# Altium project EPS.PrjPcb (part 3 of 5)

## Sheet EPS_3V3_Buck-Converter.SchDoc: 3V3 / Buck-Converter
size A4; ApprovedBy: (not approved); CheckedBy: (not checked); Author: Piotr Kuligowski; DocumentNumber: PWSat2-xxx-DW-xxx; Revision: 2; Model: EM2
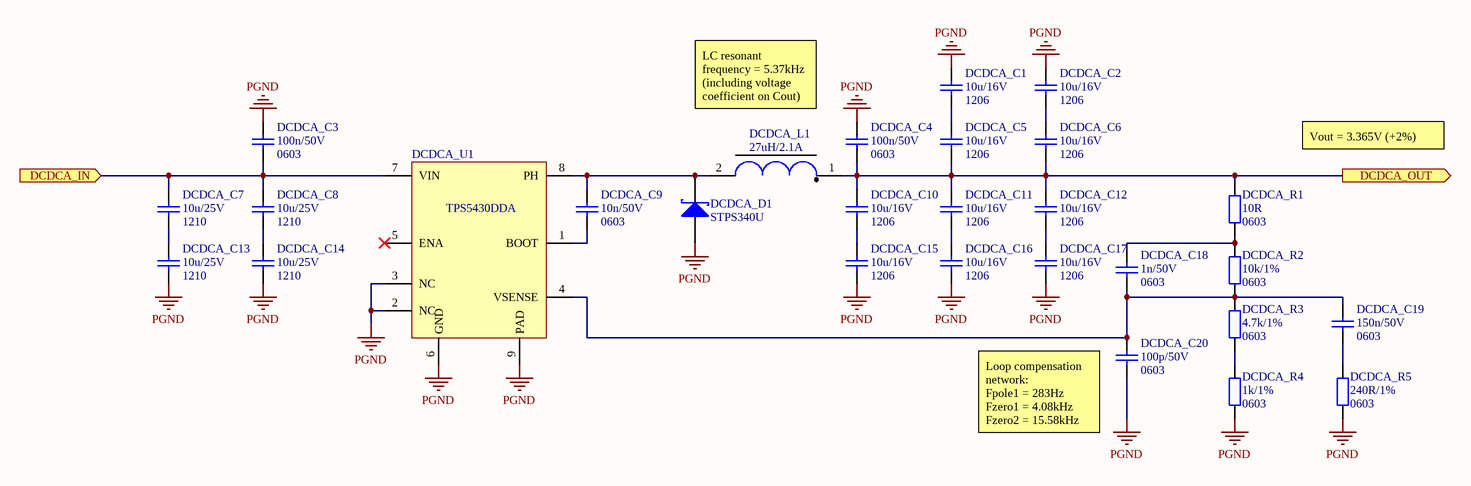
[diagram p23: EPS_3V3_Buck-Converter.SchDoc]

### Parts
DCDCA_C1  Packge: 1206  [SMD_Capacitor_1206]  (hidden comment: 10u/16V)
DCDCA_C2  Packge: 1206  [SMD_Capacitor_1206]  (hidden comment: 10u/16V)
DCDCA_C3  Package: 0603  [SMD_Capacitor_0603]  (hidden comment: 100n/50V)
DCDCA_C4  Package: 0603  [SMD_Capacitor_0603]  (hidden comment: 100n/50V)
DCDCA_C5  Packge: 1206  [SMD_Capacitor_1206]  (hidden comment: 10u/16V)
DCDCA_C6  Packge: 1206  [SMD_Capacitor_1206]  (hidden comment: 10u/16V)
DCDCA_C7  Package: 1210  [SMD_Capacitor_1210]  (hidden comment: 10u/25V)
DCDCA_C8  Package: 1210  [SMD_Capacitor_1210]  (hidden comment: 10u/25V)
DCDCA_C9  value 10n/50V  Package: 0603  [SMD_Capacitor_0603]  (hidden comment: Cap)
DCDCA_C10  Packge: 1206  [SMD_Capacitor_1206]  (hidden comment: 10u/16V)
DCDCA_C11  Packge: 1206  [SMD_Capacitor_1206]  (hidden comment: 10u/16V)
DCDCA_C12  Packge: 1206  [SMD_Capacitor_1206]  (hidden comment: 10u/16V)
DCDCA_C13  Package: 1210  [SMD_Capacitor_1210]  (hidden comment: 10u/25V)
DCDCA_C14  Package: 1210  [SMD_Capacitor_1210]  (hidden comment: 10u/25V)
DCDCA_C15  Packge: 1206  [SMD_Capacitor_1206]  (hidden comment: 10u/16V)
DCDCA_C16  Packge: 1206  [SMD_Capacitor_1206]  (hidden comment: 10u/16V)
DCDCA_C17  Packge: 1206  [SMD_Capacitor_1206]  (hidden comment: 10u/16V)
DCDCA_C18  value 1n/50V  Package: 0603  [SMD_Capacitor_0603]  (hidden comment: Cap)
DCDCA_C19  Package: 0603  [SMD_Capacitor_0603]  (hidden comment: 150n/50V)
DCDCA_C20  value 100p/50V  Package: 0603  [SMD_Capacitor_0603]  (hidden comment: Cap)
DCDCA_D1  STPS340U  [DO-214AA]
DCDCA_L1  27uH/2.1A  [Coilcraft_MSS1260]
DCDCA_R1  Package: 0603  [SMD_Resistor_0603]  (hidden comment: 10R)
DCDCA_R2  Package: 0603  [SMD_Resistor_0603]  (hidden comment: 10k/1%)
DCDCA_R3  Package: 0603  [SMD_Resistor_0603]  (hidden comment: 4.7k/1%)
DCDCA_R4  Package: 0603  [SMD_Resistor_0603]  (hidden comment: 1k/1%)
DCDCA_R5  Package: 0603  [SMD_Resistor_0603]  (hidden comment: 240R/1%)
DCDCA_U1  TPS5430DDA  [DDA-9]

### Ports
DCDCA_IN (in), DCDCA_OUT (out)

### Nets
PGND: DCDCA_C1.1 DCDCA_C2.1 DCDCA_C3.2 DCDCA_C4.2 DCDCA_C13.2 DCDCA_C14.2 DCDCA_C15.2 DCDCA_C16.2 DCDCA_C17.2 DCDCA_C20.2 DCDCA_D1.A DCDCA_R4.1 DCDCA_R5.1 DCDCA_U1.2(NC) DCDCA_U1.3(NC) DCDCA_U1.6(GND) DCDCA_U1.9(PAD)
NetDCDCA_C1_2: DCDCA_C1.2 DCDCA_C5.1
NetDCDCA_C2_2: DCDCA_C2.2 DCDCA_C6.1
NetDCDCA_C3_1: DCDCA_C3.1 DCDCA_C7.1 DCDCA_C8.1 DCDCA_U1.7(VIN) ; port DCDCA_IN
NetDCDCA_C4_1: DCDCA_C4.1 DCDCA_C5.2 DCDCA_C6.2 DCDCA_C10.1 DCDCA_C11.1 DCDCA_C12.1 DCDCA_L1.1 DCDCA_R1.2 ; port DCDCA_OUT
NetDCDCA_C7_2: DCDCA_C7.2 DCDCA_C13.1
NetDCDCA_C8_2: DCDCA_C8.2 DCDCA_C14.1
NetDCDCA_C9_1: DCDCA_C9.1 DCDCA_D1.K DCDCA_L1.2 DCDCA_U1.8(PH)
NetDCDCA_C9_2: DCDCA_C9.2 DCDCA_U1.1(BOOT)
NetDCDCA_C10_2: DCDCA_C10.2 DCDCA_C15.1
NetDCDCA_C11_2: DCDCA_C11.2 DCDCA_C16.1
NetDCDCA_C12_2: DCDCA_C12.2 DCDCA_C17.1
NetDCDCA_C18_1: DCDCA_C18.1 DCDCA_R1.1 DCDCA_R2.2
NetDCDCA_C18_2: DCDCA_C18.2 DCDCA_C19.1 DCDCA_C20.1 DCDCA_R2.1 DCDCA_R3.2 DCDCA_U1.4(VSENSE)
NetDCDCA_C19_2: DCDCA_C19.2 DCDCA_R5.2
NetDCDCA_R3_1: DCDCA_R3.1 DCDCA_R4.2

Not connected (* = marked no-connect by the designer): DCDCA_U1 5(ENA)*

### Notes on the sheet
- LC resonant frequency = 5.37kHz (including voltage coefficient on Cout)
- Vout = 3.365V (+2%)
- (near DCDCA_C20) Loop compensation network:
  Fpole1 = 283Hz
  Fzero1 = 4.08kHz
  Fzero2 = 15.58kHz
- Title:
- Project:
- Author:
- Model:
- Document Number:
- Checked by:
- Rev:
- Date:
- Approved by:
- Sheet:
- of
- File name:

### Library data of the parts
DCDCA_C1 DCDCA_C2 DCDCA_C5 DCDCA_C6 DCDCA_C10-DCDCA_C12 DCDCA_C15-DCDCA_C17 = Cer_C1206T106K4RACTU: Ceramic Cap Kemet COTS 10u/16V X7R 1206; ManufacturerPartNumber: C1206T106K4RACTU; Manufacturer: Kemet; Value: 10u/16V
DCDCA_C3 DCDCA_C4 = Cer_GCJ188R71H104KA12D: as SUMPBX_C2 on sheet EPS_MPPT_X_OR_MPB; Manufacturer: Murata; ManufacturerPartNumber: GCJ188R71H104KA12D; Value: 100n/50V
DCDCA_C7 DCDCA_C8 DCDCA_C13 DCDCA_C14 = Cer_GCJ32ER71E106KA12L: as EMIXI_C1 on sheet EPS_MPPT_X_EMI-Filter_In; Manufacturer: Murata; ManufacturerPartNumber: GCJ32ER71E106KA12L; Value: 10u/25V
DCDCA_C19 = Cer_GCM188R71H154KA64D: Ceramic Cap Murata Automotive 150n/50V X7R 0603; Manufacturer: Murata; ManufacturerPartNumber: GCM188R71H154KA64D; Value: 150n/50V
DCDCA_D1 = STPS340x: 3A/40V Power Schottky Rectifier.; Manufacturer: STMicroelectronics; Value: STPS340U
DCDCA_L1 = MSS1260-273MLx: Coilcraft MSS1260 Inductor, L=27uH, Irise20deg=2.1A, ESR=50mR, SRF=13MHz.; Manufacturer: Coilcraft; ManufacturerPartNumber: MSS1260-273MLx; Value: 27uH/2.1A
DCDCA_R1-DCDCA_R5 = Res
  DCDCA_R1: Value: 10R
  DCDCA_R2: Value: 10k/1%
  DCDCA_R3: Value: 4.7k/1%
  DCDCA_R4: Value: 1k/1%
  DCDCA_R5: Value: 240R/1%
DCDCA_U1 = TPS5430: TPS5430 3-A, Wide Input Range, Step-Down Converter; Manufacturer: Texas Instruments; Value: TPS5430DDA

## Sheet EPS_3V3_EMI-Filter_In.SchDoc: 3V3 / EMI-Filter / In
size A4; ApprovedBy: (not approved); CheckedBy: (not checked); Author: Piotr Kuligowski; DocumentNumber: PWSat2-xxx-DW-xxx; Revision: 2; Model: EM2
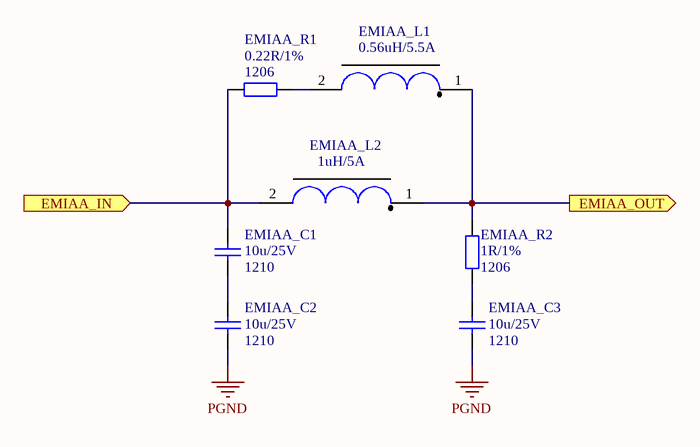
[diagram p24: EPS_3V3_EMI-Filter_In.SchDoc]

### Parts
EMIAA_C1  Package: 1210  [SMD_Capacitor_1210]  (hidden comment: 10u/25V)
EMIAA_C2  Package: 1210  [SMD_Capacitor_1210]  (hidden comment: 10u/25V)
EMIAA_C3  Package: 1210  [SMD_Capacitor_1210]  (hidden comment: 10u/25V)
EMIAA_L1  0.56uH/5.5A  [Vishay_IHLP1212]
EMIAA_L2  1uH/5A  [Vishay_IHLP1212]
EMIAA_R1  Package: 1206  [SMD_Resistor_1206]  (hidden comment: 0.22R/1%)
EMIAA_R2  Package: 1206  [SMD_Resistor_1206]  (hidden comment: 1R/1%)

### Ports
EMIAA_IN (in), EMIAA_OUT (out)

### Nets
PGND: EMIAA_C2.2 EMIAA_C3.2
NetDCDCA_C3_1: EMIAA_L1.1 EMIAA_L2.1 EMIAA_R2.2 ; port EMIAA_OUT
NetEMIAA_C1_1: EMIAA_C1.1 EMIAA_L2.2 EMIAA_R1.1 ; port EMIAA_IN
NetEMIAA_C1_2: EMIAA_C1.2 EMIAA_C2.1
NetEMIAA_C3_1: EMIAA_C3.1 EMIAA_R2.1
NetEMIAA_L1_2: EMIAA_L1.2 EMIAA_R1.2

### Notes on the sheet
- Title:
- Project:
- Author:
- Model:
- Document Number:
- Checked by:
- Rev:
- Date:
- Approved by:
- Sheet:
- of
- File name:

### Library data of the parts
EMIAA_C1-EMIAA_C3 = Cer_GCJ32ER71E106KA12L: as EMIXI_C1 on sheet EPS_MPPT_X_EMI-Filter_In; Manufacturer: Murata; ManufacturerPartNumber: GCJ32ER71E106KA12L; Value: 10u/25V
EMIAA_L1 = IHLP1212BZERR56M11: as EMIXI_L1 on sheet EPS_MPPT_X_EMI-Filter_In; Manufacturer: Vishay; ManufacturerPartNumber: IHLP1212BZERR56M11; Value: 0.56uH/5.5A
EMIAA_L2 = IHLP1212BZER1R0M11: as EMIXI_L2 on sheet EPS_MPPT_X_EMI-Filter_In; Manufacturer: Vishay; ManufacturerPartNumber: IHLP1212BZER1R0M11; Value: 1uH/5A
EMIAA_R1 = ERJ-8BQFR22V: Panasonic Resistor 0.22R 1% 1206 330mW; Manufacturer: Panasonic; ManufacturerPartNumber: ERJ-8BQFR22V; Value: 0.22R/1%
EMIAA_R2 = ERJ-8BQF1R0V: Panasonic Resistor 1R 1% 1206 330mW; ManufacturerPartNumber: ERJ-8BQF1R0V; Manufacturer: Panasonic; Value: 1R/1%

## Sheet EPS_3V3_EMI-Filter_Out.SchDoc: 3V3 / EMI-Filter / Out
size A4; ApprovedBy: (not approved); CheckedBy: (not checked); Author: Piotr Kuligowski; DocumentNumber: PWSat2-xxx-DW-xxx; Revision: 2; Model: EM2
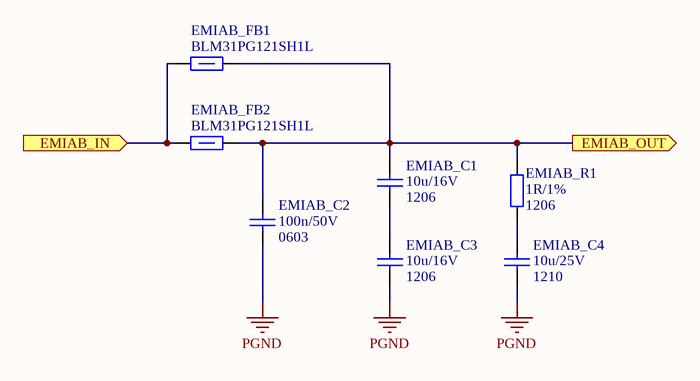
[diagram p25: EPS_3V3_EMI-Filter_Out.SchDoc]

### Parts
EMIAB_C1  Packge: 1206  [SMD_Capacitor_1206]  (hidden comment: 10u/16V)
EMIAB_C2  Package: 0603  [SMD_Capacitor_0603]  (hidden comment: 100n/50V)
EMIAB_C3  Packge: 1206  [SMD_Capacitor_1206]  (hidden comment: 10u/16V)
EMIAB_C4  Package: 1210  [SMD_Capacitor_1210]  (hidden comment: 10u/25V)
EMIAB_FB1  120R/100MHz  [SMD_FerriteBead_1206]  (value not drawn)
EMIAB_FB2  120R/100MHz  [SMD_FerriteBead_1206]  (value not drawn)
EMIAB_R1  Package: 1206  [SMD_Resistor_1206]  (hidden comment: 1R/1%)

### Ports
EMIAB_IN (in), EMIAB_OUT (out)

### Nets
PGND: EMIAB_C2.2 EMIAB_C3.2 EMIAB_C4.2
NetDCDCA_C4_1: EMIAB_FB1.2 EMIAB_FB2.2 ; port EMIAB_IN
NetEMIAB_C1_1: EMIAB_C1.1 EMIAB_C2.1 EMIAB_FB1.1 EMIAB_FB2.1 EMIAB_R1.1 ; port EMIAB_OUT
NetEMIAB_C1_2: EMIAB_C1.2 EMIAB_C3.1
NetEMIAB_C4_1: EMIAB_C4.1 EMIAB_R1.2

### Notes on the sheet
- Title:
- Project:
- Author:
- Model:
- Document Number:
- Checked by:
- Rev:
- Date:
- Approved by:
- Sheet:
- of
- File name:

### Library data of the parts
EMIAB_C1 EMIAB_C3 = Cer_C1206T106K4RACTU: Ceramic Cap Kemet COTS 10u/16V X7R 1206; ManufacturerPartNumber: C1206T106K4RACTU; Manufacturer: Kemet; Value: 10u/16V
EMIAB_C2 = Cer_C0603T104K5RALTU: Ceramic Cap Kemet COTS 100n/50V X7R 0603; Manufacturer: Kemet; ManufacturerPartNumber: C0603T104K5RALTU; Value: 100n/50V
EMIAB_C4 = Cer_GCJ32ER71E106KA12L: as EMIXI_C1 on sheet EPS_MPPT_X_EMI-Filter_In; Manufacturer: Murata; ManufacturerPartNumber: GCJ32ER71E106KA12L; Value: 10u/25V
EMIAB_FB1 EMIAB_FB2 = BLM31PG121SH1L: as EMIXO_FB1 on sheet EPS_MPPT_X_EMI-Filter_Out; Package: 1206; Value: 120R/100MHz; ManufacturerPartNumber: BLM31PG121SH1L
EMIAB_R1 = CRCW12061R00FKxxxx: 1R/1% Vishay CRCW 1206 Resistor. 250mW, 100ppm, 200V.; ManufacturerPartNumber: CRCW12061R00FKxxxx; Manufacturer: Vishay; Value: 1R/1%

## Sheet EPS_5V.SchDoc: 5V
size A4; ApprovedBy: (not approved); CheckedBy: (not checked); Author: Piotr Kuligowski; DocumentNumber: PWSat2-xxx-DW-xxx; Revision: 2; Model: EM2
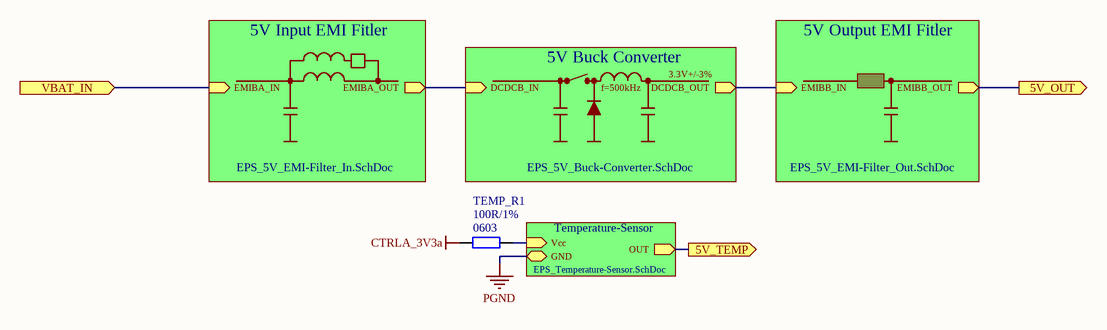
[diagram p26: EPS_5V.SchDoc]

### Parts
TEMP_R1  Package: 0603  [SMD_Resistor_0603]  (hidden comment: 100R/1%)

### Sub-sheets
5V Buck Converter = EPS_5V_Buck-Converter.SchDoc: DCDCB_OUT (out), DCDCB_IN (in)
5V Input EMI Fitler = EPS_5V_EMI-Filter_In.SchDoc: EMIBA_OUT (out), EMIBA_IN (in)
5V Output EMI Fitler = EPS_5V_EMI-Filter_Out.SchDoc: EMIBB_IN (in), EMIBB_OUT (out)
Temperature-Sensor = EPS_Temperature-Sensor.SchDoc: OUT (out), Vcc (in), GND

### Ports
5V_OUT (out), 5V_TEMP (out), VBAT_IN (in)

### Nets
CTRLA_3V3a: TEMP_R1.2
CTRLA_HK_5V_TEMP: port 5V_TEMP, sheet Temperature-Sensor/OUT
NetDCDCB_C3_1: sheet 5V Buck Converter/DCDCB_IN, sheet 5V Input EMI Fitler/EMIBA_OUT
NetDCDCB_C4_1: sheet 5V Buck Converter/DCDCB_OUT, sheet 5V Output EMI Fitler/EMIBB_IN
NetEMIAA_C1_1: port VBAT_IN, sheet 5V Input EMI Fitler/EMIBA_IN
NetEMIBB_C1_1: port 5V_OUT, sheet 5V Output EMI Fitler/EMIBB_OUT
NetTEMP_C1_Top_5V_Temperature-Sensor_1: TEMP_R1.1 ; sheet Temperature-Sensor/Vcc

### Notes on the sheet
- 3.3V+/-3%
- f=500kHz
- Title:
- Project:
- Author:
- Model:
- Document Number:
- Checked by:
- Rev:
- Date:
- Approved by:
- Sheet:
- of
- File name:

### Library data of the parts
TEMP_R1 = CRCW06031K00FKxxxx: 1k/1% Vishay CRCW 0603 Resistor. 100mW, 100ppm, 75V.; Manufacturer: Vishay; ManufacturerPartNumber: CRCW06031K00FKxxxx; Value: 100R/1%

## Sheet EPS_5V_Buck-Converter.SchDoc: 5V / Buck-Converter
size A4; ApprovedBy: (not approved); CheckedBy: (not checked); Author: Piotr Kuligowski; DocumentNumber: PWSat2-xxx-DW-xxx; Revision: 2; Model: EM2
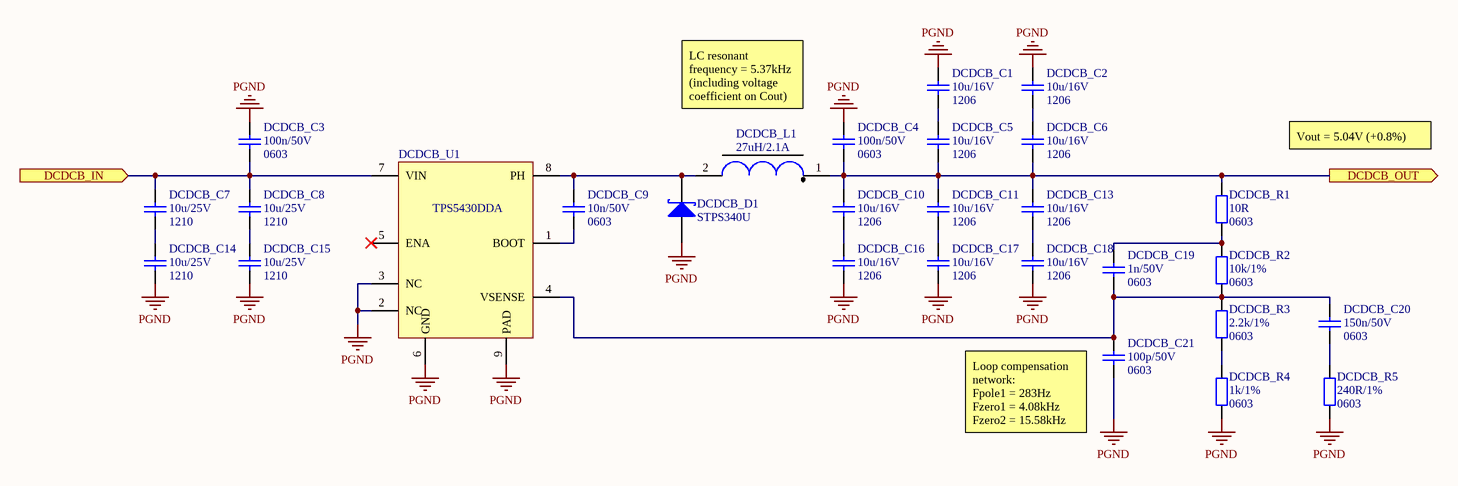
[diagram p27: EPS_5V_Buck-Converter.SchDoc]

### Parts
DCDCB_C1  Packge: 1206  [SMD_Capacitor_1206]  (hidden comment: 10u/16V)
DCDCB_C2  Packge: 1206  [SMD_Capacitor_1206]  (hidden comment: 10u/16V)
DCDCB_C3  Package: 0603  [SMD_Capacitor_0603]  (hidden comment: 100n/50V)
DCDCB_C4  Package: 0603  [SMD_Capacitor_0603]  (hidden comment: 100n/50V)
DCDCB_C5  Packge: 1206  [SMD_Capacitor_1206]  (hidden comment: 10u/16V)
DCDCB_C6  Packge: 1206  [SMD_Capacitor_1206]  (hidden comment: 10u/16V)
DCDCB_C7  Package: 1210  [SMD_Capacitor_1210]  (hidden comment: 10u/25V)
DCDCB_C8  Package: 1210  [SMD_Capacitor_1210]  (hidden comment: 10u/25V)
DCDCB_C9  value 10n/50V  Package: 0603  [SMD_Capacitor_0603]  (hidden comment: Cap)
DCDCB_C10  Packge: 1206  [SMD_Capacitor_1206]  (hidden comment: 10u/16V)
DCDCB_C11  Packge: 1206  [SMD_Capacitor_1206]  (hidden comment: 10u/16V)
DCDCB_C13  Packge: 1206  [SMD_Capacitor_1206]  (hidden comment: 10u/16V)
DCDCB_C14  Package: 1210  [SMD_Capacitor_1210]  (hidden comment: 10u/25V)
DCDCB_C15  Package: 1210  [SMD_Capacitor_1210]  (hidden comment: 10u/25V)
DCDCB_C16  Packge: 1206  [SMD_Capacitor_1206]  (hidden comment: 10u/16V)
DCDCB_C17  Packge: 1206  [SMD_Capacitor_1206]  (hidden comment: 10u/16V)
DCDCB_C18  Packge: 1206  [SMD_Capacitor_1206]  (hidden comment: 10u/16V)
DCDCB_C19  value 1n/50V  Package: 0603  [SMD_Capacitor_0603]  (hidden comment: Cap)
DCDCB_C20  Package: 0603  [SMD_Capacitor_0603]  (hidden comment: 150n/50V)
DCDCB_C21  value 100p/50V  Package: 0603  [SMD_Capacitor_0603]  (hidden comment: Cap)
DCDCB_D1  STPS340U  [DO-214AA]
DCDCB_L1  27uH/2.1A  [Coilcraft_MSS1260]
DCDCB_R1  Package: 0603  [SMD_Resistor_0603]  (hidden comment: 10R)
DCDCB_R2  Package: 0603  [SMD_Resistor_0603]  (hidden comment: 10k/1%)
DCDCB_R3  Package: 0603  [SMD_Resistor_0603]  (hidden comment: 2.2k/1%)
DCDCB_R4  Package: 0603  [SMD_Resistor_0603]  (hidden comment: 1k/1%)
DCDCB_R5  Package: 0603  [SMD_Resistor_0603]  (hidden comment: 240R/1%)
DCDCB_U1  TPS5430DDA  [DDA-9]

### Ports
DCDCB_IN (in), DCDCB_OUT (out)

### Nets
PGND: DCDCB_C1.1 DCDCB_C2.1 DCDCB_C3.2 DCDCB_C4.2 DCDCB_C14.2 DCDCB_C15.2 DCDCB_C16.2 DCDCB_C17.2 DCDCB_C18.2 DCDCB_C21.2 DCDCB_D1.A DCDCB_R4.1 DCDCB_R5.1 DCDCB_U1.2(NC) DCDCB_U1.3(NC) DCDCB_U1.6(GND) DCDCB_U1.9(PAD)
NetDCDCB_C1_2: DCDCB_C1.2 DCDCB_C5.1
NetDCDCB_C2_2: DCDCB_C2.2 DCDCB_C6.1
NetDCDCB_C3_1: DCDCB_C3.1 DCDCB_C7.1 DCDCB_C8.1 DCDCB_U1.7(VIN) ; port DCDCB_IN
NetDCDCB_C4_1: DCDCB_C4.1 DCDCB_C5.2 DCDCB_C6.2 DCDCB_C10.1 DCDCB_C11.1 DCDCB_C13.1 DCDCB_L1.1 DCDCB_R1.2 ; port DCDCB_OUT
NetDCDCB_C7_2: DCDCB_C7.2 DCDCB_C14.1
NetDCDCB_C8_2: DCDCB_C8.2 DCDCB_C15.1
NetDCDCB_C9_1: DCDCB_C9.1 DCDCB_D1.K DCDCB_L1.2 DCDCB_U1.8(PH)
NetDCDCB_C9_2: DCDCB_C9.2 DCDCB_U1.1(BOOT)
NetDCDCB_C10_2: DCDCB_C10.2 DCDCB_C16.1
NetDCDCB_C11_2: DCDCB_C11.2 DCDCB_C17.1
NetDCDCB_C13_2: DCDCB_C13.2 DCDCB_C18.1
NetDCDCB_C19_1: DCDCB_C19.1 DCDCB_R1.1 DCDCB_R2.2
NetDCDCB_C19_2: DCDCB_C19.2 DCDCB_C20.1 DCDCB_C21.1 DCDCB_R2.1 DCDCB_R3.2 DCDCB_U1.4(VSENSE)
NetDCDCB_C20_2: DCDCB_C20.2 DCDCB_R5.2
NetDCDCB_R3_1: DCDCB_R3.1 DCDCB_R4.2

Not connected (* = marked no-connect by the designer): DCDCB_U1 5(ENA)*

### Notes on the sheet
- LC resonant frequency = 5.37kHz (including voltage coefficient on Cout)
- Vout = 5.04V (+0.8%)
- (near DCDCB_C21) Loop compensation network:
  Fpole1 = 283Hz
  Fzero1 = 4.08kHz
  Fzero2 = 15.58kHz
- Title:
- Project:
- Author:
- Model:
- Document Number:
- Checked by:
- Rev:
- Date:
- Approved by:
- Sheet:
- of
- File name:

### Library data of the parts
DCDCB_C1 DCDCB_C2 DCDCB_C5 DCDCB_C6 DCDCB_C10 DCDCB_C11 DCDCB_C13 DCDCB_C16-DCDCB_C18 = Cer_C1206T106K4RACTU: Ceramic Cap Kemet COTS 10u/16V X7R 1206; ManufacturerPartNumber: C1206T106K4RACTU; Manufacturer: Kemet; Value: 10u/16V
DCDCB_C3 DCDCB_C4 = Cer_GCJ188R71H104KA12D: as SUMPBX_C2 on sheet EPS_MPPT_X_OR_MPB; Manufacturer: Murata; ManufacturerPartNumber: GCJ188R71H104KA12D; Value: 100n/50V
DCDCB_C7 DCDCB_C8 DCDCB_C14 DCDCB_C15 = Cer_GCJ32ER71E106KA12L: as EMIXI_C1 on sheet EPS_MPPT_X_EMI-Filter_In; Manufacturer: Murata; ManufacturerPartNumber: GCJ32ER71E106KA12L; Value: 10u/25V
DCDCB_C20 = Cer_GCM188R71H154KA64D: as DCDCA_C19 on sheet EPS_3V3_Buck-Converter; Manufacturer: Murata; ManufacturerPartNumber: GCM188R71H154KA64D; Value: 150n/50V
DCDCB_D1 = STPS340x: as DCDCA_D1 on sheet EPS_3V3_Buck-Converter; Value: STPS340U
DCDCB_L1 = MSS1260-273MLx: as DCDCA_L1 on sheet EPS_3V3_Buck-Converter; Manufacturer: Coilcraft; ManufacturerPartNumber: MSS1260-273MLx; Value: 27uH/2.1A
DCDCB_R1-DCDCB_R5 = Res
  DCDCB_R1: Value: 10R
  DCDCB_R2: Value: 10k/1%
  DCDCB_R3: Value: 2.2k/1%
  DCDCB_R4: Value: 1k/1%
  DCDCB_R5: Value: 240R/1%
DCDCB_U1 = TPS5430: as DCDCA_U1 on sheet EPS_3V3_Buck-Converter; Value: TPS5430DDA

## Sheet EPS_5V_EMI-Filter_In.SchDoc: 5V / EMI-Filter / In
size A4; ApprovedBy: (not approved); CheckedBy: (not checked); Author: Piotr Kuligowski; DocumentNumber: PWSat2-xxx-DW-xxx; Revision: 2; Model: EM2
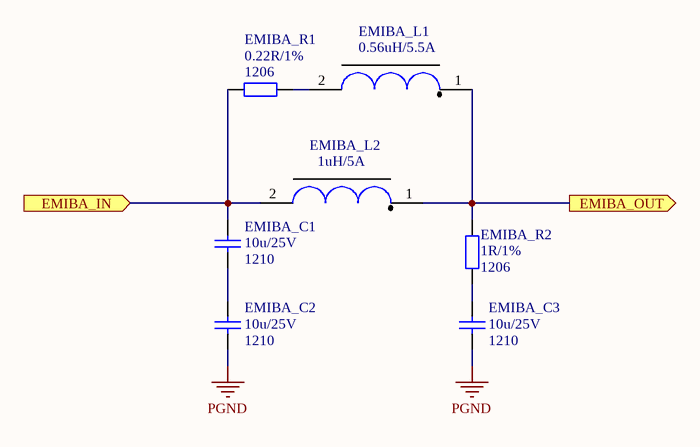
[diagram p28: EPS_5V_EMI-Filter_In.SchDoc]

### Parts
EMIBA_C1  Package: 1210  [SMD_Capacitor_1210]  (hidden comment: 10u/25V)
EMIBA_C2  Package: 1210  [SMD_Capacitor_1210]  (hidden comment: 10u/25V)
EMIBA_C3  Package: 1210  [SMD_Capacitor_1210]  (hidden comment: 10u/25V)
EMIBA_L1  0.56uH/5.5A  [Vishay_IHLP1212]
EMIBA_L2  1uH/5A  [Vishay_IHLP1212]
EMIBA_R1  Package: 1206  [SMD_Resistor_1206]  (hidden comment: 0.22R/1%)
EMIBA_R2  Package: 1206  [SMD_Resistor_1206]  (hidden comment: 1R/1%)

### Ports
EMIBA_IN (in), EMIBA_OUT (out)

### Nets
PGND: EMIBA_C2.2 EMIBA_C3.2
NetDCDCB_C3_1: EMIBA_L1.1 EMIBA_L2.1 EMIBA_R2.2 ; port EMIBA_OUT
NetEMIAA_C1_1: EMIBA_C1.1 EMIBA_L2.2 EMIBA_R1.1 ; port EMIBA_IN
NetEMIBA_C1_2: EMIBA_C1.2 EMIBA_C2.1
NetEMIBA_C3_1: EMIBA_C3.1 EMIBA_R2.1
NetEMIBA_L1_2: EMIBA_L1.2 EMIBA_R1.2

### Notes on the sheet
- Title:
- Project:
- Author:
- Model:
- Document Number:
- Checked by:
- Rev:
- Date:
- Approved by:
- Sheet:
- of
- File name:

### Library data of the parts
EMIBA_C1-EMIBA_C3 = Cer_GCJ32ER71E106KA12L: Ceramic Cap Murata Automotive 10u/25V X7R 1210; Manufacturer: Murata; ManufacturerPartNumber: GCJ32ER71E106KA12L; Value: 10u/25V
EMIBA_L1 = IHLP1212BZERR56M11: Vishay IHLP1212 Inductor, L=0.56uH, Irise40deg=5.5A, ESR=16mR, SRF=1MHz.; Manufacturer: Vishay; ManufacturerPartNumber: IHLP1212BZERR56M11; Value: 0.56uH/5.5A
EMIBA_L2 = IHLP1212BZER1R0M11: Vishay IHLP1212 Inductor, L=1uH, Irise40deg=5A, ESR=20mR, SRF=1MHz.; Manufacturer: Vishay; ManufacturerPartNumber: IHLP1212BZER1R0M11; Value: 1uH/5A
EMIBA_R1 = ERJ-8BQFR22V: Panasonic Resistor 0.22R 1% 1206 330mW; Manufacturer: Panasonic; ManufacturerPartNumber: ERJ-8BQFR22V; Value: 0.22R/1%
EMIBA_R2 = ERJ-8BQF1R0V: Panasonic Resistor 1R 1% 1206 330mW; ManufacturerPartNumber: ERJ-8BQF1R0V; Manufacturer: Panasonic; Value: 1R/1%

## Sheet EPS_5V_EMI-Filter_Out.SchDoc: 5V / EMI-Filter / Out
size A4; ApprovedBy: (not approved); CheckedBy: (not checked); Author: Piotr Kuligowski; DocumentNumber: PWSat2-xxx-DW-xxx; Revision: 2; Model: EM2
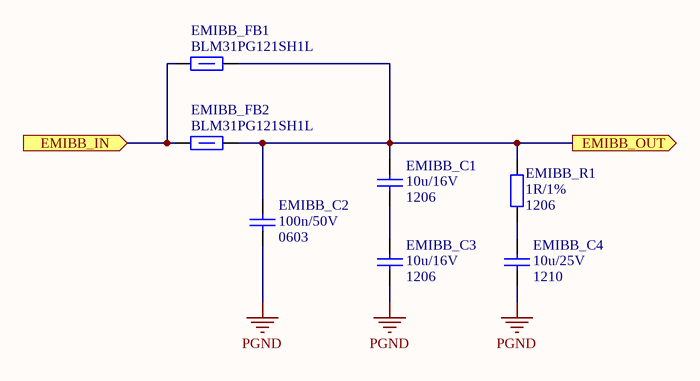
[diagram p29: EPS_5V_EMI-Filter_Out.SchDoc]

### Parts
EMIBB_C1  Packge: 1206  [SMD_Capacitor_1206]  (hidden comment: 10u/16V)
EMIBB_C2  Package: 0603  [SMD_Capacitor_0603]  (hidden comment: 100n/50V)
EMIBB_C3  Packge: 1206  [SMD_Capacitor_1206]  (hidden comment: 10u/16V)
EMIBB_C4  Package: 1210  [SMD_Capacitor_1210]  (hidden comment: 10u/25V)
EMIBB_FB1  120R/100MHz  [SMD_FerriteBead_1206]  (value not drawn)
EMIBB_FB2  120R/100MHz  [SMD_FerriteBead_1206]  (value not drawn)
EMIBB_R1  Package: 1206  [SMD_Resistor_1206]  (hidden comment: 1R/1%)

### Ports
EMIBB_IN (in), EMIBB_OUT (out)

### Nets
PGND: EMIBB_C2.2 EMIBB_C3.2 EMIBB_C4.2
NetDCDCB_C4_1: EMIBB_FB1.2 EMIBB_FB2.2 ; port EMIBB_IN
NetEMIBB_C1_1: EMIBB_C1.1 EMIBB_C2.1 EMIBB_FB1.1 EMIBB_FB2.1 EMIBB_R1.1 ; port EMIBB_OUT
NetEMIBB_C1_2: EMIBB_C1.2 EMIBB_C3.1
NetEMIBB_C4_1: EMIBB_C4.1 EMIBB_R1.2

### Notes on the sheet
- Title:
- Project:
- Author:
- Model:
- Document Number:
- Checked by:
- Rev:
- Date:
- Approved by:
- Sheet:
- of
- File name:

### Library data of the parts
EMIBB_C1 EMIBB_C3 = Cer_C1206T106K4RACTU: Ceramic Cap Kemet COTS 10u/16V X7R 1206; ManufacturerPartNumber: C1206T106K4RACTU; Manufacturer: Kemet; Value: 10u/16V
EMIBB_C2 = Cer_C0603T104K5RALTU: Ceramic Cap Kemet COTS 100n/50V X7R 0603; Manufacturer: Kemet; ManufacturerPartNumber: C0603T104K5RALTU; Value: 100n/50V
EMIBB_C4 = Cer_GCJ32ER71E106KA12L: as EMIBA_C1-EMIBA_C3 on sheet EPS_5V_EMI-Filter_In; Manufacturer: Murata; ManufacturerPartNumber: GCJ32ER71E106KA12L; Value: 10u/25V
EMIBB_FB1 EMIBB_FB2 = BLM31PG121SH1L: Ferrite bead, 1206, 0.02HM, 3.5A.; Manufacturer: Murata; Current Rating: 3.5A; Series Resistance DC: 0.02R; Package: 1206; Value: 120R/100MHz; ManufacturerPartNumber: BLM31PG121SH1L
EMIBB_R1 = CRCW12061R00FKxxxx: 1R/1% Vishay CRCW 1206 Resistor. 250mW, 100ppm, 200V.; ManufacturerPartNumber: CRCW12061R00FKxxxx; Manufacturer: Vishay; Value: 1R/1%

## Sheet EPS_RBL.SchDoc: Remove Before Launch
size A4; ApprovedBy: (not approved); CheckedBy: (not checked); Author: Piotr Kuligowski; DocumentNumber: PWSat2-xxx-DW-xxx; Revision: 2; Model: EM2
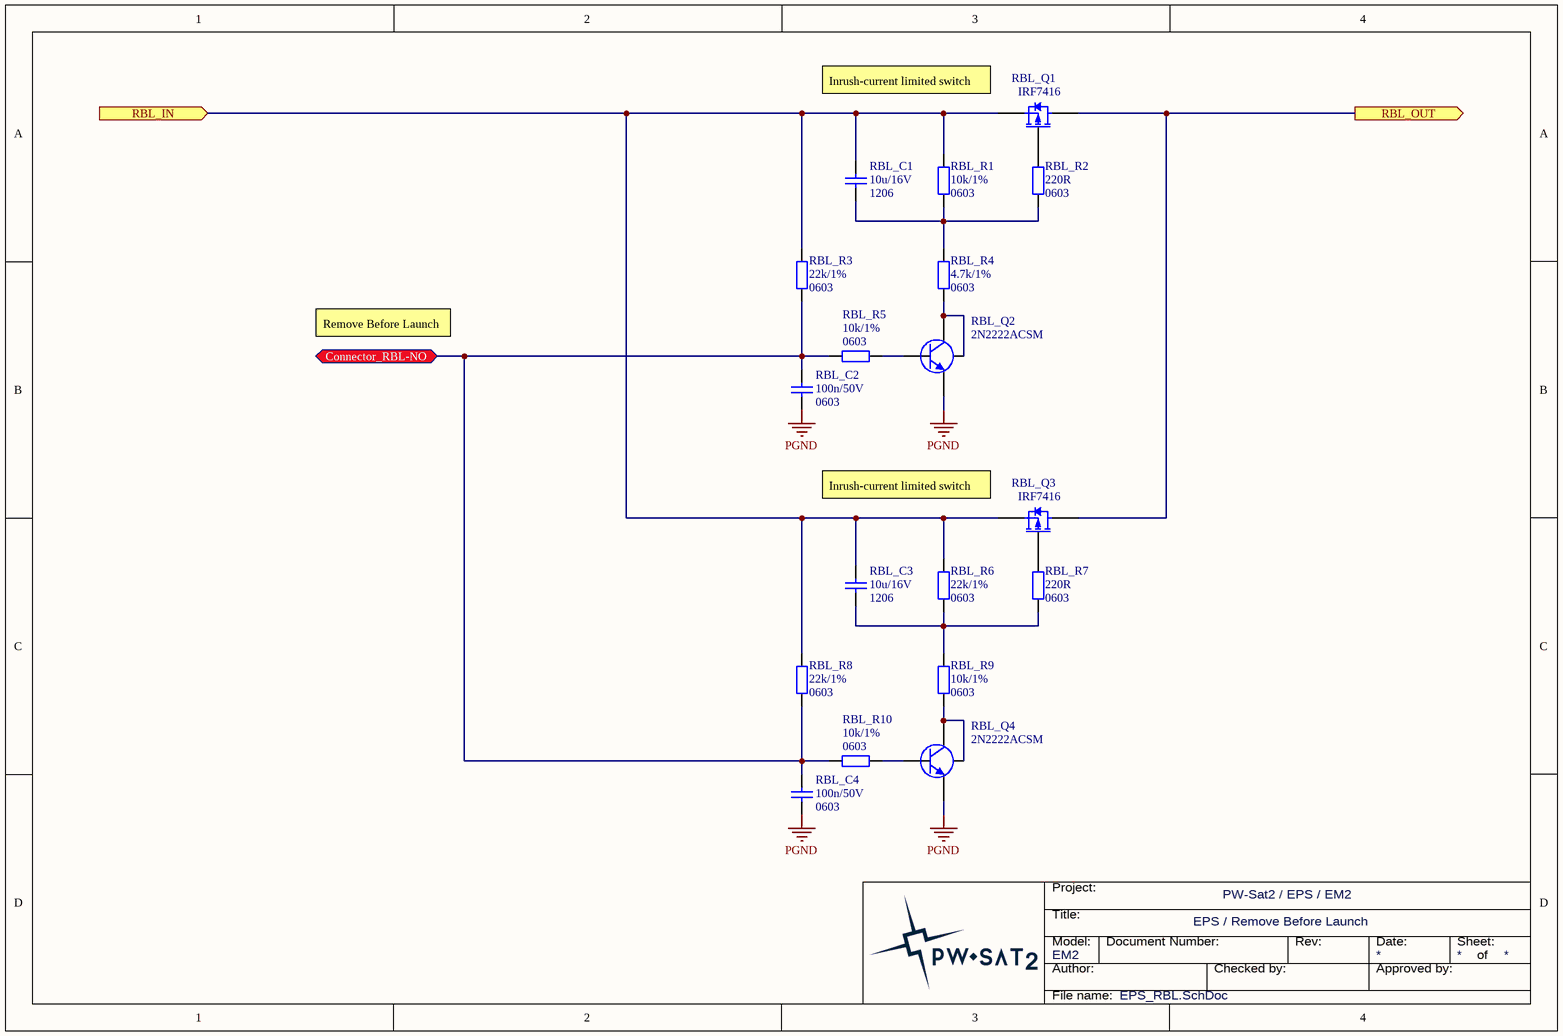
[diagram p30: EPS_RBL.SchDoc]

### Parts
RBL_C1  Packge: 1206  [SMD_Capacitor_1206]  (hidden comment: 10u/16V)
RBL_C2  Package: 0603  [SMD_Capacitor_0603]  (hidden comment: 100n/50V)
RBL_C3  Packge: 1206  [SMD_Capacitor_1206]  (hidden comment: 10u/16V)
RBL_C4  Package: 0603  [SMD_Capacitor_0603]  (hidden comment: 100n/50V)
RBL_Q1  IRF7416  [SOIC-8-N_SSSGDDDD]
RBL_Q2  2N2222ACSM  [LCC1-4_BEC]
RBL_Q3  IRF7416  [SOIC-8-N_SSSGDDDD]
RBL_Q4  2N2222ACSM  [LCC1-4_BEC]
RBL_R1  Package: 0603  [SMD_Resistor_0603]  (hidden comment: 10k/1%)
RBL_R2  Package: 0603  [SMD_Resistor_0603]  (hidden comment: 220R)
RBL_R3  Package: 0603  [SMD_Resistor_0603]  (hidden comment: 22k/1%)
RBL_R4  Package: 0603  [SMD_Resistor_0603]  (hidden comment: 4.7k/1%)
RBL_R5  Package: 0603  [SMD_Resistor_0603]  (hidden comment: 10k/1%)
RBL_R6  Package: 0603  [SMD_Resistor_0603]  (hidden comment: 22k/1%)
RBL_R7  Package: 0603  [SMD_Resistor_0603]  (hidden comment: 220R)
RBL_R8  Package: 0603  [SMD_Resistor_0603]  (hidden comment: 22k/1%)
RBL_R9  Package: 0603  [SMD_Resistor_0603]  (hidden comment: 10k/1%)
RBL_R10  Package: 0603  [SMD_Resistor_0603]  (hidden comment: 10k/1%)

### Ports
Connector_RBL-NO (bidir), RBL_IN (in), RBL_OUT (out)

### Nets
PGND: RBL_C2.2 RBL_C4.2 RBL_Q2.E RBL_Q4.E
NetH3_1: RBL_C1.1 RBL_C3.1 RBL_Q1.S RBL_Q3.S RBL_R1.1 RBL_R3.1 RBL_R6.1 RBL_R8.1 ; port RBL_IN
NetH5_2: RBL_C2.1 RBL_C4.1 RBL_R3.2 RBL_R5.1 RBL_R8.2 RBL_R10.1 ; port Connector_RBL-NO
NetLCLTK_C1_LCL-TK_MAIN_1: RBL_Q1.D RBL_Q3.D ; port RBL_OUT
NetRBL_C1_2: RBL_C1.2 RBL_R1.2 RBL_R2.2 RBL_R4.1
NetRBL_C3_2: RBL_C3.2 RBL_R6.2 RBL_R7.2 RBL_R9.1
NetRBL_Q1_G: RBL_Q1.G RBL_R2.1
NetRBL_Q2_B: RBL_Q2.B RBL_R5.2
NetRBL_Q2_C: RBL_Q2.C RBL_Q2.Shield RBL_R4.2
NetRBL_Q3_G: RBL_Q3.G RBL_R7.1
NetRBL_Q4_B: RBL_Q4.B RBL_R10.2
NetRBL_Q4_C: RBL_Q4.C RBL_Q4.Shield RBL_R9.2

### Notes on the sheet
- (near RBL_Q1) Inrush-current limited switch
- Remove Before Launch
- (near RBL_Q3) Inrush-current limited switch
- Title:
- Project:
- Author:
- Model:
- Document Number:
- Checked by:
- Rev:
- Date:
- Approved by:
- Sheet:
- of
- File name:

### Library data of the parts
RBL_C1 RBL_C3 = Cer_C1206T106K4RACTU: Ceramic Cap Kemet COTS 10u/16V X7R 1206; ManufacturerPartNumber: C1206T106K4RACTU; Manufacturer: Kemet; Value: 10u/16V
RBL_C2 RBL_C4 = Cer_GCJ188R71H104KA12D: Ceramic Cap Murata Automotive 100n/50V X7R 0603; Manufacturer: Murata; ManufacturerPartNumber: GCJ188R71H104KA12D; Value: 100n/50V
RBL_Q1 RBL_Q3 = IRF7416: 10A/30V HEXFET Power P-MOSFET.; Manufacturer: International Rectifier; Value: IRF7416
RBL_Q2 RBL_Q4 = 2N2222ACSM: Silicon Planar Epitaxial NPN Transistor.; Manufacturer: Semelab-TT; Value: 2N2222ACSM
RBL_R1-RBL_R10 = Res
  RBL_R1 RBL_R5 RBL_R9 RBL_R10: Value: 10k/1%
  RBL_R2 RBL_R7: Value: 220R
  RBL_R3 RBL_R6 RBL_R8: Value: 22k/1%
  RBL_R4: Value: 4.7k/1%

## Sheet EPS_Distribution.SchDoc: Distribution
size A3; ApprovedBy: (not approved); CheckedBy: (not checked); Author: Piotr Kuligowski; DocumentNumber: PWSat2-xxx-DW-xxx; Revision: 2; Model: EM2
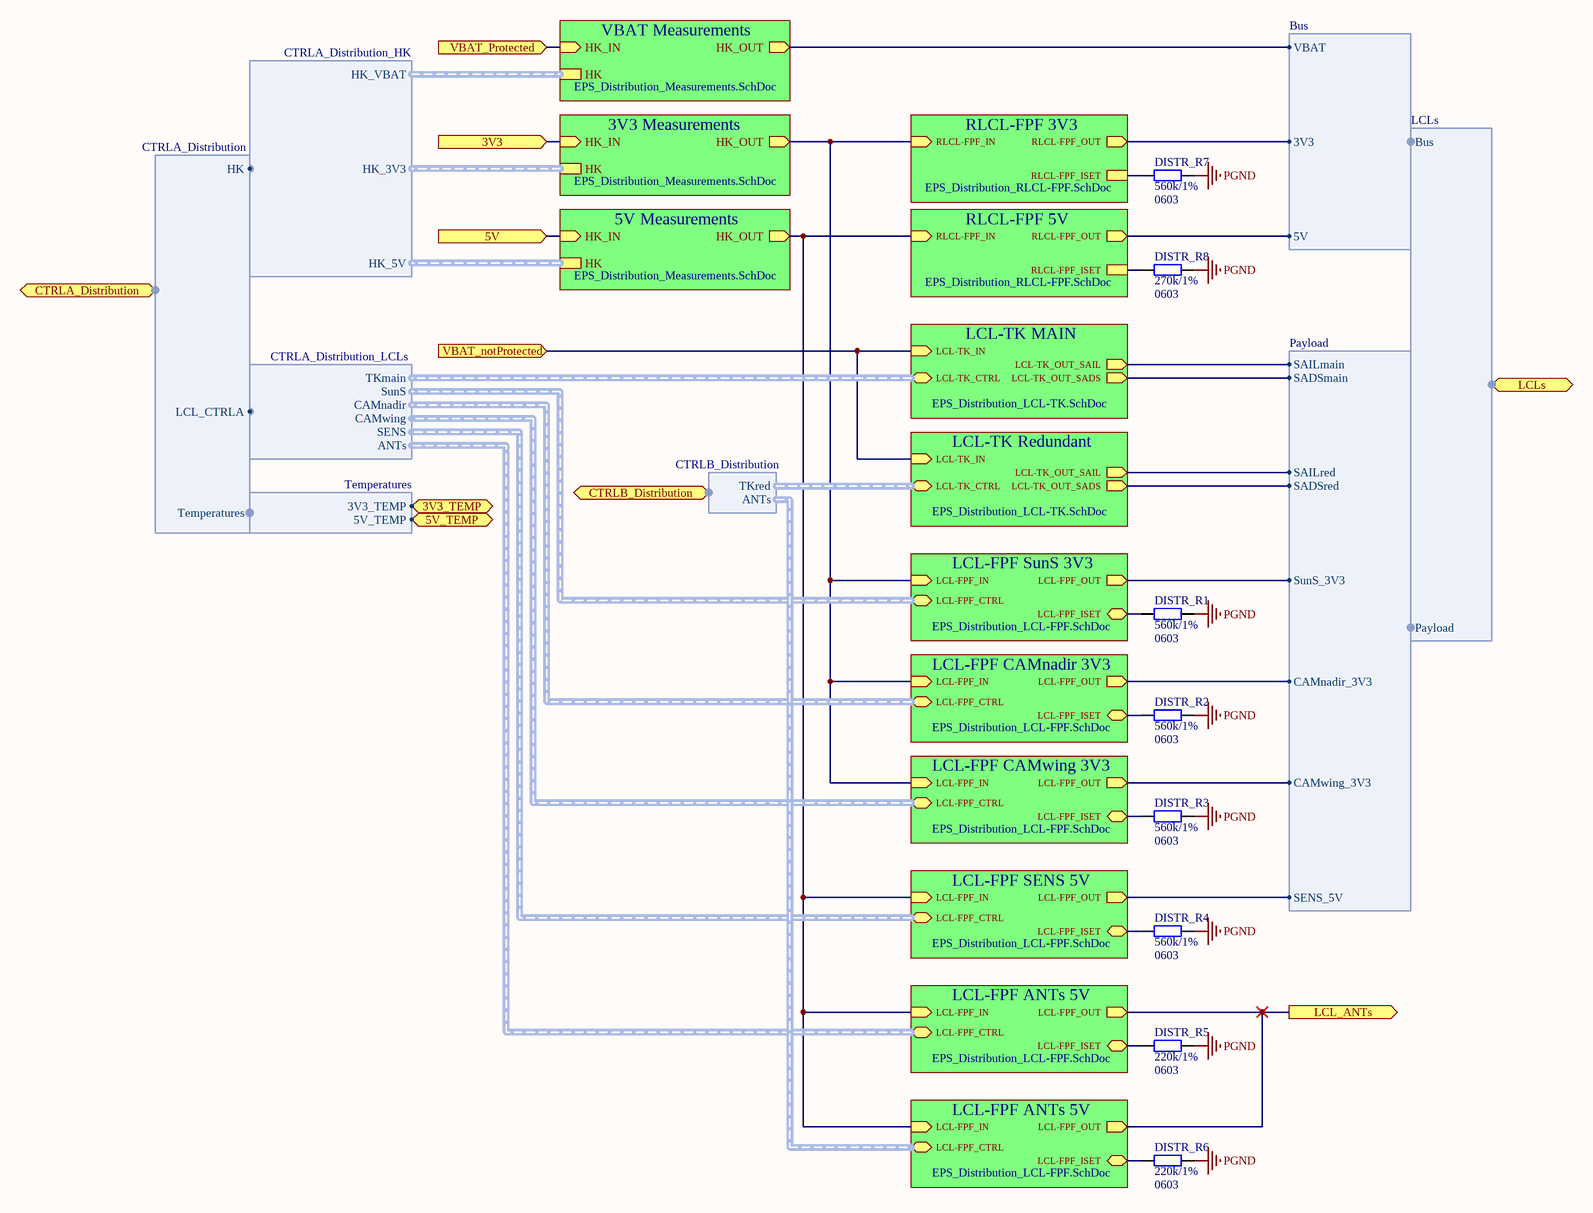
[diagram p31: EPS_Distribution.SchDoc]

### Parts
DISTR_R1  Package: 0603  [SMD_Resistor_0603]  (hidden comment: 560k/1%)
DISTR_R2  Package: 0603  [SMD_Resistor_0603]  (hidden comment: 560k/1%)
DISTR_R3  Package: 0603  [SMD_Resistor_0603]  (hidden comment: 560k/1%)
DISTR_R4  Package: 0603  [SMD_Resistor_0603]  (hidden comment: 560k/1%)
DISTR_R5  Package: 0603  [SMD_Resistor_0603]  (hidden comment: 220k/1%)
DISTR_R6  Package: 0603  [SMD_Resistor_0603]  (hidden comment: 220k/1%)
DISTR_R7  Package: 0603  [SMD_Resistor_0603]  (hidden comment: 560k/1%)
DISTR_R8  Package: 0603  [SMD_Resistor_0603]  (hidden comment: 270k/1%)

### Sub-sheets
3V3 Measurements = EPS_Distribution_Measurements.SchDoc: HK_IN (in), HK_OUT (out), HK (harness HK)
5V Measurements = EPS_Distribution_Measurements.SchDoc: HK_IN (in), HK_OUT (out), HK (harness HK)
LCL-FPF ANTs 5V = EPS_Distribution_LCL-FPF.SchDoc: LCL-FPF_OUT (out), LCL-FPF_ISET, LCL-FPF_IN (in), LCL-FPF_CTRL (harness LCL-FPF_CTRL)
LCL-FPF ANTs 5V = EPS_Distribution_LCL-FPF.SchDoc: LCL-FPF_OUT (out), LCL-FPF_ISET, LCL-FPF_IN (in), LCL-FPF_CTRL (harness LCL-FPF_CTRL)
LCL-FPF CAMnadir 3V3 = EPS_Distribution_LCL-FPF.SchDoc: LCL-FPF_OUT (out), LCL-FPF_ISET, LCL-FPF_IN (in), LCL-FPF_CTRL (harness LCL-FPF_CTRL)
LCL-FPF CAMwing 3V3 = EPS_Distribution_LCL-FPF.SchDoc: LCL-FPF_OUT (out), LCL-FPF_ISET, LCL-FPF_IN (in), LCL-FPF_CTRL (harness LCL-FPF_CTRL)
LCL-FPF SENS 5V = EPS_Distribution_LCL-FPF.SchDoc: LCL-FPF_OUT (out), LCL-FPF_ISET, LCL-FPF_IN (in), LCL-FPF_CTRL (harness LCL-FPF_CTRL)
LCL-FPF SunS 3V3 = EPS_Distribution_LCL-FPF.SchDoc: LCL-FPF_OUT (out), LCL-FPF_ISET, LCL-FPF_IN (in), LCL-FPF_CTRL (harness LCL-FPF_CTRL)
LCL-TK MAIN = EPS_Distribution_LCL-TK.SchDoc: LCL-TK_IN (in), LCL-TK_OUT_SADS (out), LCL-TK_CTRL (harness LCL-TK_CTRL), LCL-TK_OUT_SAIL (out)
LCL-TK Redundant = EPS_Distribution_LCL-TK.SchDoc: LCL-TK_IN (in), LCL-TK_OUT_SADS (out), LCL-TK_CTRL (harness LCL-TK_CTRL), LCL-TK_OUT_SAIL (out)
RLCL-FPF 3V3 = EPS_Distribution_RLCL-FPF.SchDoc: RLCL-FPF_IN (in), RLCL-FPF_OUT (out), RLCL-FPF_ISET
RLCL-FPF 5V = EPS_Distribution_RLCL-FPF.SchDoc: RLCL-FPF_IN (in), RLCL-FPF_OUT (out), RLCL-FPF_ISET
VBAT Measurements = EPS_Distribution_Measurements.SchDoc: HK_IN (in), HK_OUT (out), HK (harness HK)

### Ports
3V3 (in), 3V3_TEMP (in), 5V (in), 5V_TEMP (in), CTRLA_Distribution (harness CTRLA_Distribution), CTRLB_Distribution (harness CTRLB_Distribution), LCL_ANTs (out), LCLs (harness LCLs), VBAT_notProtected (in), VBAT_Protected (in)

### Harnesses
LCLs: Payload, Bus
Payload: SADSred, SAILred, SENS_5V, SAILmain, SADSmain, SunS_3V3, CAMnadir_3V3, CAMwing_3V3
CTRLB_Distribution: TKred, ANTs
Bus: 3V3, 5V, VBAT
CTRLA_Distribution_HK: HK_VBAT, HK_3V3, HK_5V
CTRLA_Distribution_LCLs: TKmain, SunS, CAMnadir, CAMwing, SENS, ANTs
CTRLA_Distribution: LCL_CTRLA, HK, Temperatures
Temperatures: 3V3_TEMP, 5V_TEMP

### Nets
PGND: DISTR_R1.1 DISTR_R2.1 DISTR_R3.1 DISTR_R4.1 DISTR_R5.1 DISTR_R6.1 DISTR_R7.1 DISTR_R8.1
CTRLA_HK_3V3_TEMP: port 3V3_TEMP, harness Temperatures.3V3_TEMP
CTRLA_HK_5V_TEMP: port 5V_TEMP, harness Temperatures.5V_TEMP
PC-104_LCL_3V3: sheet RLCL-FPF 3V3/RLCL-FPF_OUT, harness Bus.3V3
PC-104_LCL_5V: sheet RLCL-FPF 5V/RLCL-FPF_OUT, harness Bus.5V
PC-104_LCL_CAMnadir_3V3: sheet LCL-FPF CAMnadir 3V3/LCL-FPF_OUT, harness Payload.CAMnadir_3V3
PC-104_LCL_CAMwing_3V3: sheet LCL-FPF CAMwing 3V3/LCL-FPF_OUT, harness Payload.CAMwing_3V3
PC-104_LCL_SADSmain: sheet LCL-TK MAIN/LCL-TK_OUT_SADS, harness Payload.SADSmain
PC-104_LCL_SADSred: sheet LCL-TK Redundant/LCL-TK_OUT_SADS, harness Payload.SADSred
PC-104_LCL_SAILmain: sheet LCL-TK MAIN/LCL-TK_OUT_SAIL, harness Payload.SAILmain
PC-104_LCL_SAILred: sheet LCL-TK Redundant/LCL-TK_OUT_SAIL, harness Payload.SAILred
PC-104_LCL_SENS_5V: sheet LCL-FPF SENS 5V/LCL-FPF_OUT, harness Payload.SENS_5V
PC-104_LCL_SunS_3V3: sheet LCL-FPF SunS 3V3/LCL-FPF_OUT, harness Payload.SunS_3V3
PC-104_LCL_VBAT: sheet VBAT Measurements/HK_OUT, harness Bus.VBAT
NetDISTR_R1_2: DISTR_R1.2 ; sheet LCL-FPF SunS 3V3/LCL-FPF_ISET
NetDISTR_R2_2: DISTR_R2.2 ; sheet LCL-FPF CAMnadir 3V3/LCL-FPF_ISET
NetDISTR_R3_2: DISTR_R3.2 ; sheet LCL-FPF CAMwing 3V3/LCL-FPF_ISET
NetDISTR_R4_2: DISTR_R4.2 ; sheet LCL-FPF SENS 5V/LCL-FPF_ISET
NetDISTR_R5_2: DISTR_R5.2 ; sheet LCL-FPF ANTs 5V/LCL-FPF_ISET
NetDISTR_R6_2: DISTR_R6.2 ; sheet LCL-FPF ANTs 5V/LCL-FPF_ISET
NetDISTR_R7_2: DISTR_R7.2 ; sheet RLCL-FPF 3V3/RLCL-FPF_ISET
NetDISTR_R8_2: DISTR_R8.2 ; sheet RLCL-FPF 5V/RLCL-FPF_ISET
NetEMIAB_C1_1: port 3V3, sheet 3V3 Measurements/HK_IN
NetEMIBB_C1_1: port 5V, sheet 5V Measurements/HK_IN
NetEMIVBAT_C1_1: port VBAT_Protected, sheet VBAT Measurements/HK_IN
NetH8_1: port LCL_ANTs, sheet LCL-FPF ANTs 5V/LCL-FPF_OUT, sheet LCL-FPF ANTs 5V/LCL-FPF_OUT
NetHK_R1_3V3_Measurements_4: sheet LCL-FPF SunS 3V3/LCL-FPF_IN, sheet LCL-FPF CAMnadir 3V3/LCL-FPF_IN, sheet LCL-FPF CAMwing 3V3/LCL-FPF_IN, sheet 3V3 Measurements/HK_OUT, sheet RLCL-FPF 3V3/RLCL-FPF_IN
NetHK_R1_5V_Measurements_4: sheet LCL-FPF SENS 5V/LCL-FPF_IN, sheet RLCL-FPF 5V/RLCL-FPF_IN, sheet 5V Measurements/HK_OUT, sheet LCL-FPF ANTs 5V/LCL-FPF_IN, sheet LCL-FPF ANTs 5V/LCL-FPF_IN
NetLCLTK_C1_LCL-TK_MAIN_1: port VBAT_notProtected, sheet LCL-TK MAIN/LCL-TK_IN, sheet LCL-TK Redundant/LCL-TK_IN

### Notes on the sheet
- Title:
- Project:
- Author:
- Model:
- Document Number:
- Checked by:
- Rev:
- Date:
- Approved by:
- Sheet:
- of
- File name:

### Library data of the parts
DISTR_R1-DISTR_R8 = Res
  DISTR_R1-DISTR_R4 DISTR_R7: Value: 560k/1%
  DISTR_R5 DISTR_R6: Value: 220k/1%
  DISTR_R8: Value: 270k/1%

## Sheet EPS_Distribution_LCL-FPF.SchDoc: Distribution / LCL-FPF
size A4; ApprovedBy: (not approved); CheckedBy: (not checked); Author: Piotr Kuligowski; DocumentNumber: PWSat2-xxx-DW-xxx; Revision: 2; Model: EM2
Used 6 times, as channels Top/Distribution/LCL-FPF SunS 3V3, Top/Distribution/LCL-FPF CAMnadir 3V3, Top/Distribution/LCL-FPF CAMwing 3V3, Top/Distribution/LCL-FPF SENS 5V, Top/Distribution/LCL-FPF ANTs 5V, Top/Distribution/LCL-FPF ANTs 5V. Parts and nets are listed once, with the designators drawn on the sheet.
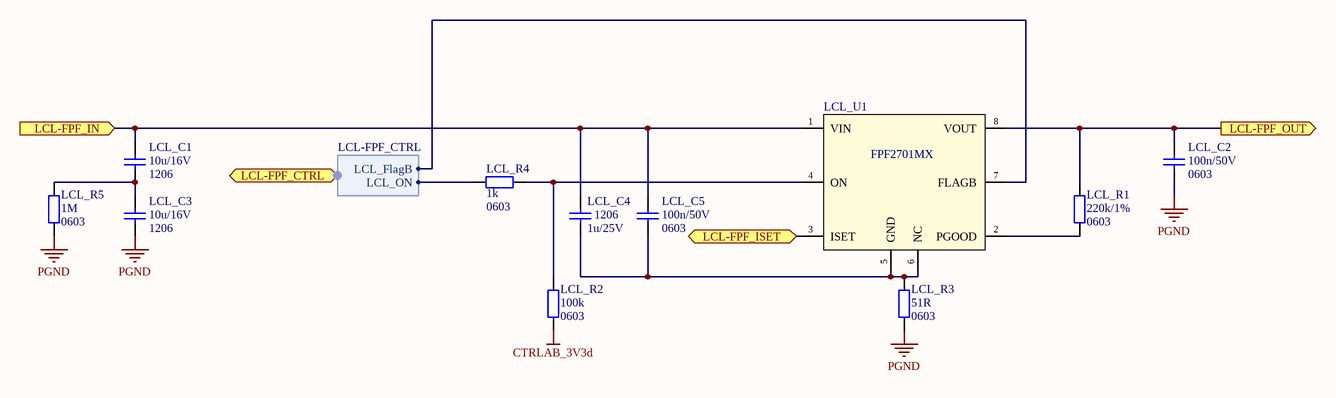
[diagram p32: EPS_Distribution_LCL-FPF.SchDoc]

### Parts
LCL_C1  Packge: 1206  [SMD_Capacitor_1206]  (hidden comment: 10u/16V)
LCL_C2  Package: 0603  [SMD_Capacitor_0603]  (hidden comment: 100n/50V)
LCL_C3  Packge: 1206  [SMD_Capacitor_1206]  (hidden comment: 10u/16V)
LCL_C4  Package: 1206  [SMD_Capacitor_1206]  (hidden comment: 1u/25V)
LCL_C5  Package: 0603  [SMD_Capacitor_0603]  (hidden comment: 100n/50V)
LCL_R1  Package: 0603  [SMD_Resistor_0603]  (hidden comment: 220k/1%)
LCL_R2  Package: 0603  [SMD_Resistor_0603]  (hidden comment: 100k)
LCL_R3  Package: 0603  [SMD_Resistor_0603]  (hidden comment: 51R)
LCL_R4  Package: 0603  [SMD_Resistor_0603]  (hidden comment: 1k)
LCL_R5  Package: 0603  [SMD_Resistor_0603]  (hidden comment: 1M)
LCL_U1  FPF2701MX  [SOIC-8-N]

### Ports
LCL-FPF_CTRL (harness LCL-FPF_CTRL), LCL-FPF_IN (in), LCL-FPF_ISET, LCL-FPF_OUT (out)

### Harnesses
LCL-FPF_CTRL: LCL_FlagB, LCL_ON

### Nets
CTRLAB_3V3d: LCL_R2.1
PGND: LCL_C2.2 LCL_C3.2 LCL_R3.1 LCL_R5.1
LCL-FPF_IN: LCL_C1.1 LCL_C4.1 LCL_C5.1 LCL_U1.1(VIN) ; port LCL-FPF_IN
LCL-FPF_ISET: LCL_U1.3(ISET) ; port LCL-FPF_ISET
LCL-FPF_OUT: LCL_C2.1 LCL_R1.2 LCL_U1.8(VOUT) ; port LCL-FPF_OUT
NetLCL_C1_2: LCL_C1.2 LCL_C3.1 LCL_R5.2
NetLCL_C4_2: LCL_C4.2 LCL_C5.2 LCL_R3.2 LCL_U1.5(GND) LCL_U1.6(NC)
NetLCL_R1_1: LCL_R1.1 LCL_U1.2(PGOOD)
NetLCL_R2_2: LCL_R2.2 LCL_R4.1 LCL_U1.4(ON)
NetLCL_R4_2: LCL_R4.2 ; port LCL-FPF_CTRL.LCL_ON
NetLCL_U1_7: LCL_U1.7(FLAGB) ; port LCL-FPF_CTRL.LCL_FlagB

### Channels
Top/Distribution/LCL-FPF SunS 3V3: designators end in _LCL-FPF_SunS_3V3; ports LCL-FPF_IN=NetHK_R1_3V3_Measurements_4 LCL-FPF_ISET=NetDISTR_R1_2 LCL-FPF_OUT=PC-104_LCL_SunS_3V3
Top/Distribution/LCL-FPF CAMnadir 3V3: designators end in _LCL-FPF_CAMnadir_3V3; ports LCL-FPF_IN=NetHK_R1_3V3_Measurements_4 LCL-FPF_ISET=NetDISTR_R2_2 LCL-FPF_OUT=PC-104_LCL_CAMnadir_3V3
Top/Distribution/LCL-FPF CAMwing 3V3: designators end in _LCL-FPF_CAMwing_3V3; ports LCL-FPF_IN=NetHK_R1_3V3_Measurements_4 LCL-FPF_ISET=NetDISTR_R3_2 LCL-FPF_OUT=PC-104_LCL_CAMwing_3V3
Top/Distribution/LCL-FPF SENS 5V: designators end in _LCL-FPF_SENS_5V; ports LCL-FPF_IN=NetHK_R1_5V_Measurements_4 LCL-FPF_ISET=NetDISTR_R4_2 LCL-FPF_OUT=PC-104_LCL_SENS_5V
Top/Distribution/LCL-FPF ANTs 5V: designators end in _Top_Distribution_LCL-FPF_ANTs_5V#1; ports LCL-FPF_IN=NetHK_R1_5V_Measurements_4 LCL-FPF_ISET=NetDISTR_R5_2 LCL-FPF_OUT=NetH8_1
Top/Distribution/LCL-FPF ANTs 5V: designators end in _Top_Distribution_LCL-FPF_ANTs_5V#2; ports LCL-FPF_IN=NetHK_R1_5V_Measurements_4 LCL-FPF_ISET=NetDISTR_R6_2 LCL-FPF_OUT=NetH8_1

### Notes on the sheet
- Title:
- Project:
- Author:
- Model:
- Document Number:
- Checked by:
- Rev:
- Date:
- Approved by:
- Sheet:
- of
- File name:

### Library data of the parts
LCL_C1 LCL_C3 = Cer_C1206T106K4RACTU: Ceramic Cap Kemet COTS 10u/16V X7R 1206; ManufacturerPartNumber: C1206T106K4RACTU; Manufacturer: Kemet; Value: 10u/16V
LCL_C2 LCL_C5 = Cer_C0603T104K5RALTU: Ceramic Cap Kemet COTS 100n/50V X7R 0603; Manufacturer: Kemet; ManufacturerPartNumber: C0603T104K5RALTU; Value: 100n/50V
LCL_C4 = Cer_C1206T105K3RALTU: Ceramic Cap Kemet COTS 1u/25V X7R 1206; ManufacturerPartNumber: C1206T105K3RALTU; Manufacturer: Kemet; Value: 1u/25V
LCL_R1-LCL_R5 = Res
  LCL_R1: Value: 220k/1%
  LCL_R2: Value: 100k
  LCL_R3: Value: 51R
  LCL_R4: Value: 1k
  LCL_R5: Value: 1M
LCL_U1 = FPF2701MX: Adj over-current protection 0.4-2A, Load Switch; Manufacturer: Fairchild Semiconductor; Value: FPF2701MX

## Sheet EPS_Distribution_LCL-TK.SchDoc: Distribution / LCL-TK
size A3; ApprovedBy: (not approved); CheckedBy: (not checked); Author: Piotr Kuligowski; DocumentNumber: PWSat2-xxx-DW-xxx; Revision: 2; Model: EM2
Used 2 times, as channels Top/Distribution/LCL-TK MAIN, Top/Distribution/LCL-TK Redundant. Parts and nets are listed once, with the designators drawn on the sheet.
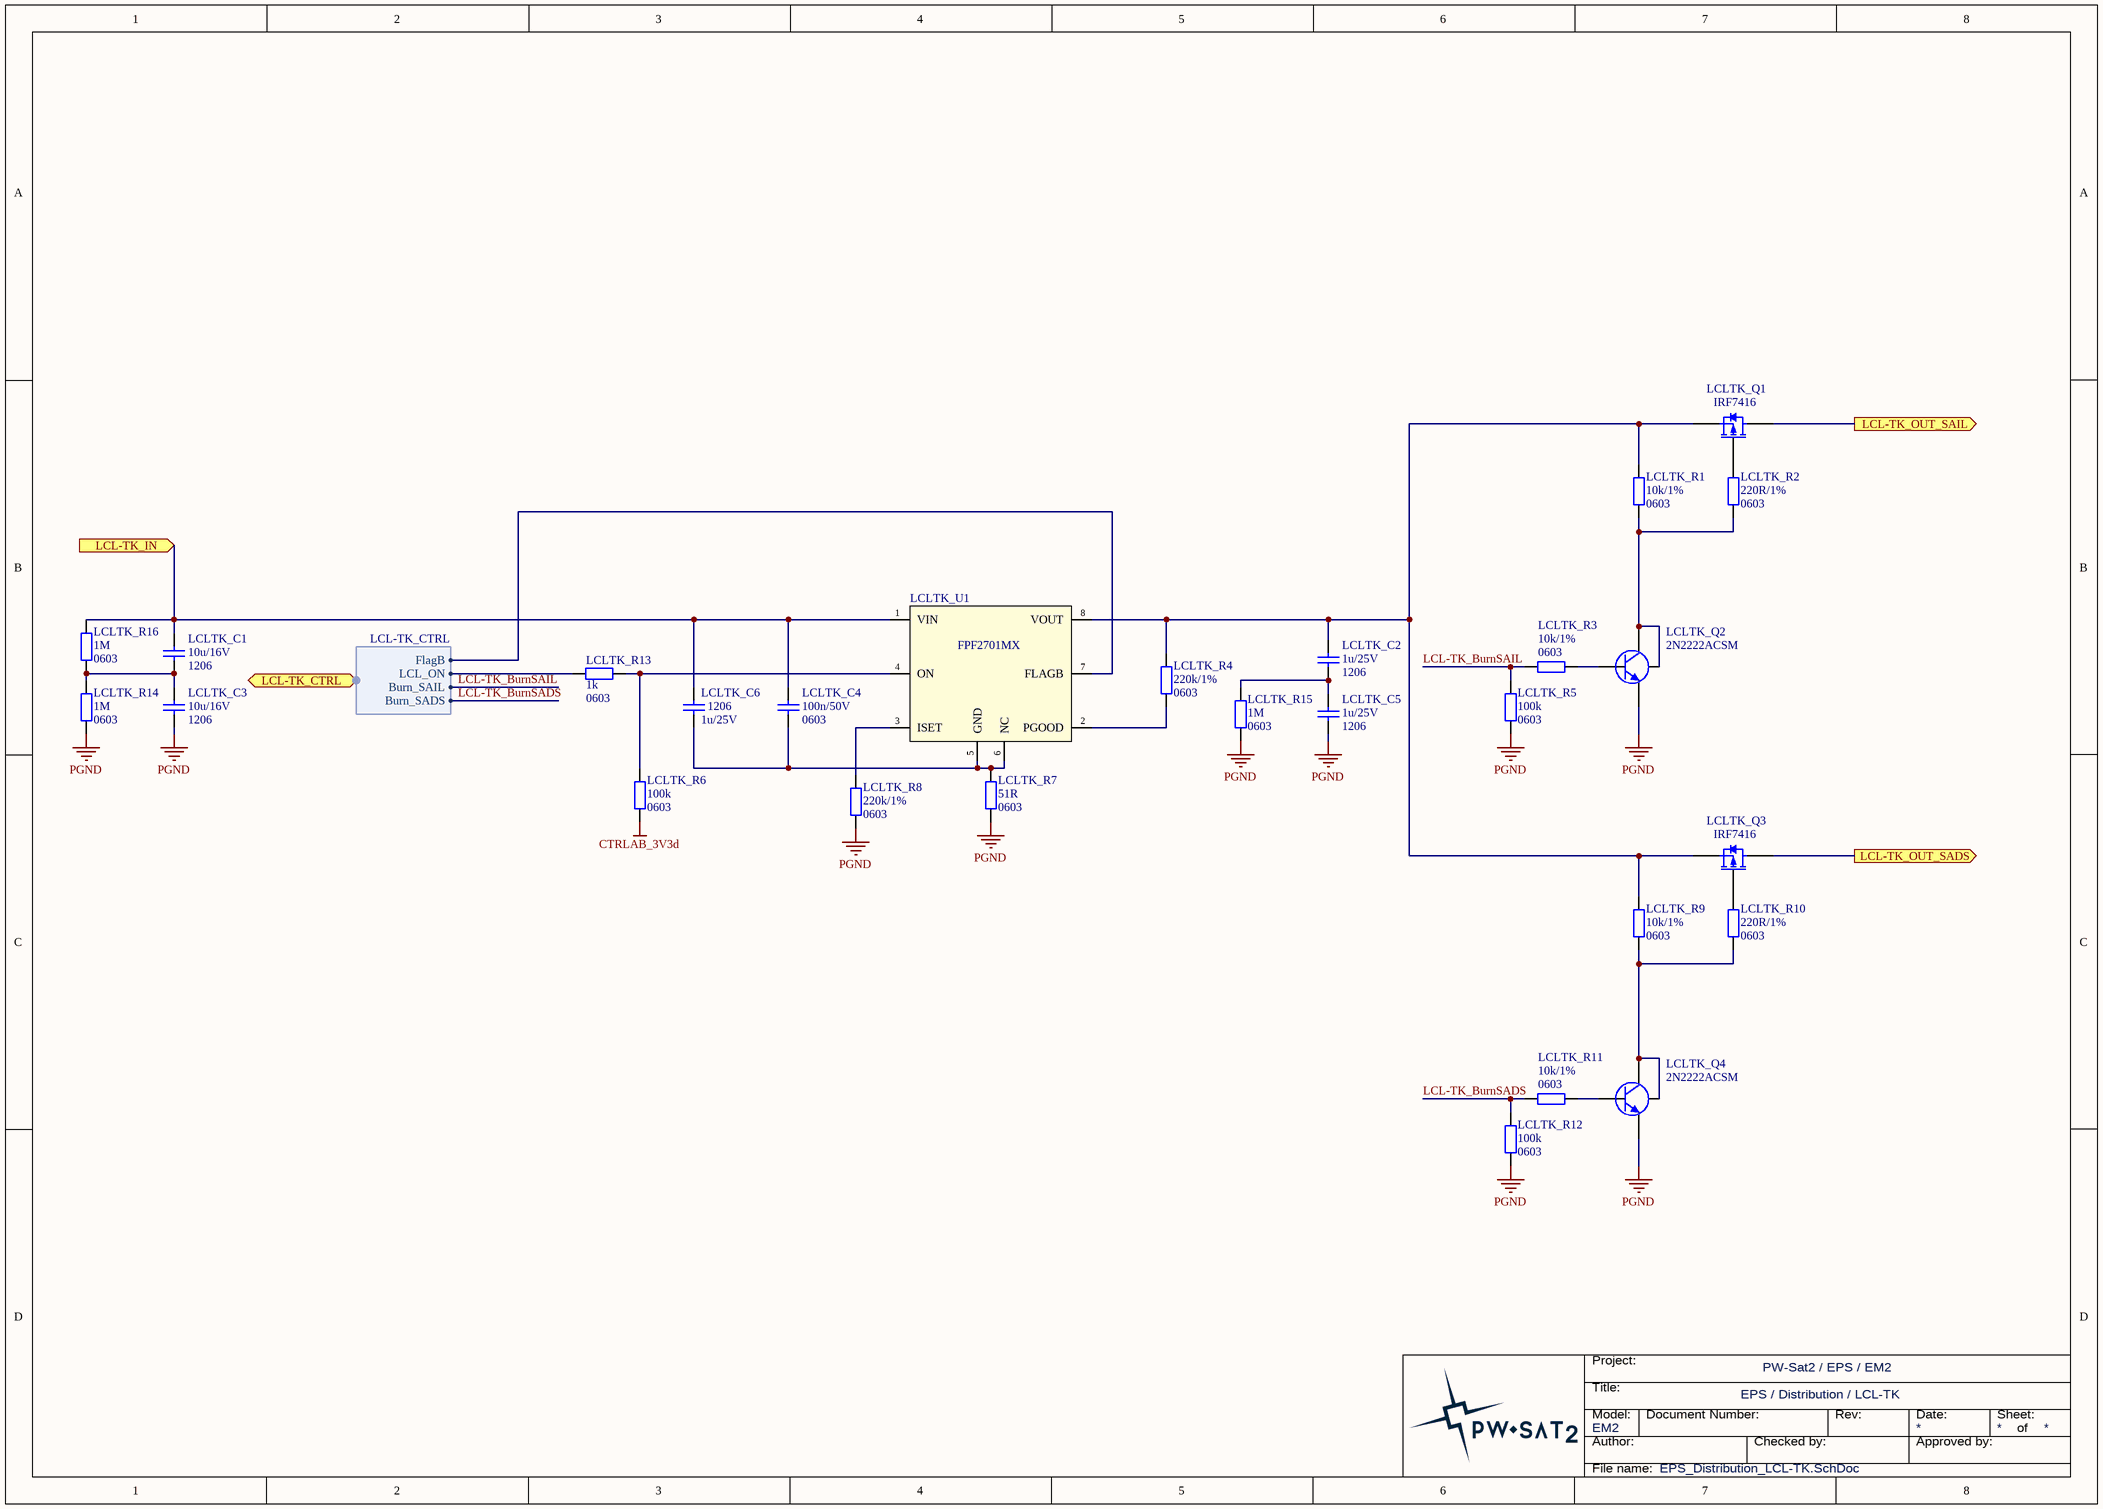
[diagram p33: EPS_Distribution_LCL-TK.SchDoc]

### Parts
LCLTK_C1  Packge: 1206  [SMD_Capacitor_1206]  (hidden comment: 10u/16V)
LCLTK_C2  Package: 1206  [SMD_Capacitor_1206]  (hidden comment: 1u/25V)
LCLTK_C3  Packge: 1206  [SMD_Capacitor_1206]  (hidden comment: 10u/16V)
LCLTK_C4  Package: 0603  [SMD_Capacitor_0603]  (hidden comment: 100n/50V)
LCLTK_C5  Package: 1206  [SMD_Capacitor_1206]  (hidden comment: 1u/25V)
LCLTK_C6  Package: 1206  [SMD_Capacitor_1206]  (hidden comment: 1u/25V)
LCLTK_Q1  IRF7416  [SOIC-8-N_SSSGDDDD]
LCLTK_Q2  2N2222ACSM  [LCC1-4_BEC]
LCLTK_Q3  IRF7416  [SOIC-8-N_SSSGDDDD]
LCLTK_Q4  2N2222ACSM  [LCC1-4_BEC]
LCLTK_R1  Package: 0603  [SMD_Resistor_0603]  (hidden comment: 10k/1%)
LCLTK_R2  Package: 0603  [SMD_Resistor_0603]  (hidden comment: 220R/1%)
LCLTK_R3  Package: 0603  [SMD_Resistor_0603]  (hidden comment: 10k/1%)
LCLTK_R4  Package: 0603  [SMD_Resistor_0603]  (hidden comment: 220k/1%)
LCLTK_R5  Package: 0603  [SMD_Resistor_0603]  (hidden comment: 100k)
LCLTK_R6  Package: 0603  [SMD_Resistor_0603]  (hidden comment: 100k)
LCLTK_R7  Package: 0603  [SMD_Resistor_0603]  (hidden comment: 51R)
LCLTK_R8  Package: 0603  [SMD_Resistor_0603]  (hidden comment: 220k/1%)
LCLTK_R9  Package: 0603  [SMD_Resistor_0603]  (hidden comment: 10k/1%)
LCLTK_R10  Package: 0603  [SMD_Resistor_0603]  (hidden comment: 220R/1%)
LCLTK_R11  Package: 0603  [SMD_Resistor_0603]  (hidden comment: 10k/1%)
LCLTK_R12  Package: 0603  [SMD_Resistor_0603]  (hidden comment: 100k)
LCLTK_R13  Package: 0603  [SMD_Resistor_0603]  (hidden comment: 1k)
LCLTK_R14  Package: 0603  [SMD_Resistor_0603]  (hidden comment: 1M)
LCLTK_R15  Package: 0603  [SMD_Resistor_0603]  (hidden comment: 1M)
LCLTK_R16  Package: 0603  [SMD_Resistor_0603]  (hidden comment: 1M)
LCLTK_U1  FPF2701MX  [SOIC-8-N]

### Ports
LCL-TK_CTRL (harness LCL-TK_CTRL), LCL-TK_IN (in), LCL-TK_OUT_SADS (out), LCL-TK_OUT_SAIL (out)

### Harnesses
LCL-TK_CTRL: FlagB, LCL_ON, Burn_SAIL, Burn_SADS

### Nets
CTRLAB_3V3d: LCLTK_R6.1
PGND: LCLTK_C3.2 LCLTK_C5.2 LCLTK_Q2.E LCLTK_Q4.E LCLTK_R5.1 LCLTK_R7.1 LCLTK_R8.1 LCLTK_R12.1 LCLTK_R14.1 LCLTK_R15.1
LCL-TK_BurnSADS: LCLTK_R11.2 LCLTK_R12.2 ; port LCL-TK_CTRL.Burn_SADS
LCL-TK_BurnSAIL: LCLTK_R3.2 LCLTK_R5.2 ; port LCL-TK_CTRL.Burn_SAIL
LCL-TK_IN: LCLTK_C1.1 LCLTK_C4.1 LCLTK_C6.1 LCLTK_R16.2 LCLTK_U1.1(VIN) ; port LCL-TK_IN
LCL-TK_OUT_SADS: LCLTK_Q3.D ; port LCL-TK_OUT_SADS
LCL-TK_OUT_SAIL: LCLTK_Q1.D ; port LCL-TK_OUT_SAIL
NetLCLTK_C1_2: LCLTK_C1.2 LCLTK_C3.1 LCLTK_R14.2 LCLTK_R16.1
NetLCLTK_C2_1: LCLTK_C2.1 LCLTK_Q1.S LCLTK_Q3.S LCLTK_R1.2 LCLTK_R4.2 LCLTK_R9.2 LCLTK_U1.8(VOUT)
NetLCLTK_C2_2: LCLTK_C2.2 LCLTK_C5.1 LCLTK_R15.2
NetLCLTK_C4_2: LCLTK_C4.2 LCLTK_C6.2 LCLTK_R7.2 LCLTK_U1.5(GND) LCLTK_U1.6(NC)
NetLCLTK_Q1_G: LCLTK_Q1.G LCLTK_R2.2
NetLCLTK_Q2_B: LCLTK_Q2.B LCLTK_R3.1
NetLCLTK_Q2_C: LCLTK_Q2.C LCLTK_Q2.Shield LCLTK_R1.1 LCLTK_R2.1
NetLCLTK_Q3_G: LCLTK_Q3.G LCLTK_R10.2
NetLCLTK_Q4_B: LCLTK_Q4.B LCLTK_R11.1
NetLCLTK_Q4_C: LCLTK_Q4.C LCLTK_Q4.Shield LCLTK_R9.1 LCLTK_R10.1
NetLCLTK_R4_1: LCLTK_R4.1 LCLTK_U1.2(PGOOD)
NetLCLTK_R6_2: LCLTK_R6.2 LCLTK_R13.1 LCLTK_U1.4(ON)
NetLCLTK_R8_2: LCLTK_R8.2 LCLTK_U1.3(ISET)
NetLCLTK_R13_2: LCLTK_R13.2 ; port LCL-TK_CTRL.LCL_ON
NetLCLTK_U1_7: LCLTK_U1.7(FLAGB) ; port LCL-TK_CTRL.FlagB

### Channels
Top/Distribution/LCL-TK MAIN: designators end in _LCL-TK_MAIN; ports LCL-TK_IN=NetLCLTK_C1_LCL-TK_MAIN_1 LCL-TK_OUT_SADS=PC-104_LCL_SADSmain LCL-TK_OUT_SAIL=PC-104_LCL_SAILmain
Top/Distribution/LCL-TK Redundant: designators end in _LCL-TK_Redundant; ports LCL-TK_IN=NetLCLTK_C1_LCL-TK_MAIN_1 LCL-TK_OUT_SADS=PC-104_LCL_SADSred LCL-TK_OUT_SAIL=PC-104_LCL_SAILred

### Notes on the sheet
- Title:
- Project:
- Author:
- Model:
- Document Number:
- Checked by:
- Rev:
- Date:
- Approved by:
- Sheet:
- of
- File name:

### Library data of the parts
LCLTK_C1 LCLTK_C3 = Cer_C1206T106K4RACTU: Ceramic Cap Kemet COTS 10u/16V X7R 1206; ManufacturerPartNumber: C1206T106K4RACTU; Manufacturer: Kemet; Value: 10u/16V
LCLTK_C2 LCLTK_C5 LCLTK_C6 = Cer_C1206T105K3RALTU: Ceramic Cap Kemet COTS 1u/25V X7R 1206; ManufacturerPartNumber: C1206T105K3RALTU; Manufacturer: Kemet; Value: 1u/25V
LCLTK_C4 = Cer_C0603T104K5RALTU: Ceramic Cap Kemet COTS 100n/50V X7R 0603; Manufacturer: Kemet; ManufacturerPartNumber: C0603T104K5RALTU; Value: 100n/50V
LCLTK_Q1 LCLTK_Q3 = IRF7416: as RBL_Q1 on sheet EPS_RBL; Value: IRF7416
LCLTK_Q2 LCLTK_Q4 = 2N2222ACSM: as RBL_Q2 on sheet EPS_RBL; Value: 2N2222ACSM
LCLTK_R1-LCLTK_R16 = Res
  LCLTK_R1 LCLTK_R3 LCLTK_R9 LCLTK_R11: Value: 10k/1%
  LCLTK_R2 LCLTK_R10: Value: 220R/1%
  LCLTK_R4 LCLTK_R8: Value: 220k/1%
  LCLTK_R5 LCLTK_R6 LCLTK_R12: Value: 100k
  LCLTK_R7: Value: 51R
  LCLTK_R13: Value: 1k
  LCLTK_R14-LCLTK_R16: Value: 1M
LCLTK_U1 = FPF2701MX: as LCL_U1 on sheet EPS_Distribution_LCL-FPF; Value: FPF2701MX

## Sheet EPS_Distribution_RLCL-FPF.SchDoc: Distribution / RLCL-FPF
size A4; ApprovedBy: (not approved); CheckedBy: (not checked); Author: Piotr Kuligowski; DocumentNumber: PWSat2-xxx-DW-xxx; Revision: 2; Model: EM2
Used 2 times, as channels Top/Distribution/RLCL-FPF 5V, Top/Distribution/RLCL-FPF 3V3. Parts and nets are listed once, with the designators drawn on the sheet.
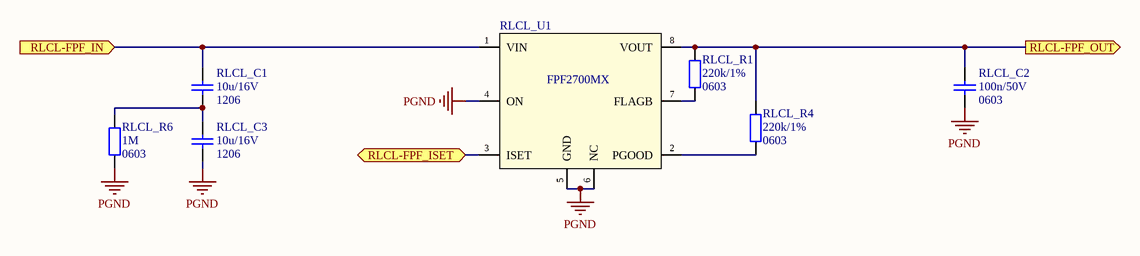
[diagram p34: EPS_Distribution_RLCL-FPF.SchDoc]

### Parts
RLCL_C1  Packge: 1206  [SMD_Capacitor_1206]  (hidden comment: 10u/16V)
RLCL_C2  Package: 0603  [SMD_Capacitor_0603]  (hidden comment: 100n/50V)
RLCL_C3  Packge: 1206  [SMD_Capacitor_1206]  (hidden comment: 10u/16V)
RLCL_R1  Package: 0603  [SMD_Resistor_0603]  (hidden comment: 220k/1%)
RLCL_R4  Package: 0603  [SMD_Resistor_0603]  (hidden comment: 220k/1%)
RLCL_R6  Package: 0603  [SMD_Resistor_0603]  (hidden comment: 1M)
RLCL_U1  FPF2700MX  [SOIC-8-N]

### Ports
RLCL-FPF_IN (in), RLCL-FPF_ISET, RLCL-FPF_OUT (out)

### Nets
PGND: RLCL_C2.2 RLCL_C3.2 RLCL_R6.1 RLCL_U1.4(ON) RLCL_U1.5(GND) RLCL_U1.6(NC)
RLCL-FPF_IN: RLCL_C1.1 RLCL_U1.1(VIN) ; port RLCL-FPF_IN
RLCL-FPF_ISET: RLCL_U1.3(ISET) ; port RLCL-FPF_ISET
RLCL-FPF_OUT: RLCL_C2.1 RLCL_R1.2 RLCL_R4.2 RLCL_U1.8(VOUT) ; port RLCL-FPF_OUT
NetRLCL_C1_2: RLCL_C1.2 RLCL_C3.1 RLCL_R6.2
NetRLCL_R1_1: RLCL_R1.1 RLCL_U1.7(FLAGB)
NetRLCL_R4_1: RLCL_R4.1 RLCL_U1.2(PGOOD)

### Channels
Top/Distribution/RLCL-FPF 5V: designators end in _RLCL-FPF_5V; ports RLCL-FPF_IN=NetHK_R1_5V_Measurements_4 RLCL-FPF_ISET=NetDISTR_R8_2 RLCL-FPF_OUT=PC-104_LCL_5V
Top/Distribution/RLCL-FPF 3V3: designators end in _RLCL-FPF_3V3; ports RLCL-FPF_IN=NetHK_R1_3V3_Measurements_4 RLCL-FPF_ISET=NetDISTR_R7_2 RLCL-FPF_OUT=PC-104_LCL_3V3

### Notes on the sheet
- Title:
- Project:
- Author:
- Model:
- Document Number:
- Checked by:
- Rev:
- Date:
- Approved by:
- Sheet:
- of
- File name:

### Library data of the parts
RLCL_C1 RLCL_C3 = Cer_C1206T106K4RACTU: Ceramic Cap Kemet COTS 10u/16V X7R 1206; ManufacturerPartNumber: C1206T106K4RACTU; Manufacturer: Kemet; Value: 10u/16V
RLCL_C2 = Cer_C0603T104K5RALTU: Ceramic Cap Kemet COTS 100n/50V X7R 0603; Manufacturer: Kemet; ManufacturerPartNumber: C0603T104K5RALTU; Value: 100n/50V
RLCL_R1 RLCL_R4 RLCL_R6 = Res
  RLCL_R1 RLCL_R4: Value: 220k/1%
  RLCL_R6: Value: 1M
RLCL_U1 = FPF2700MX: Adj over-current protection 0.4-2A with auto-reset, Load Switch; Manufacturer: Fairchild Semiconductor; Value: FPF2700MX

## Sheet EPS_Distribution_Measurements.SchDoc: Distribution / Measurements
size A4; ApprovedBy: (not approved); CheckedBy: (not checked); Author: Piotr Kuligowski; DocumentNumber: PWSat2-xxx-DW-xxx; Revision: 2; Model: EM2
Used 3 times, as channels Top/Distribution/5V Measurements, Top/Distribution/3V3 Measurements, Top/Distribution/VBAT Measurements. Parts and nets are listed once, with the designators drawn on the sheet.
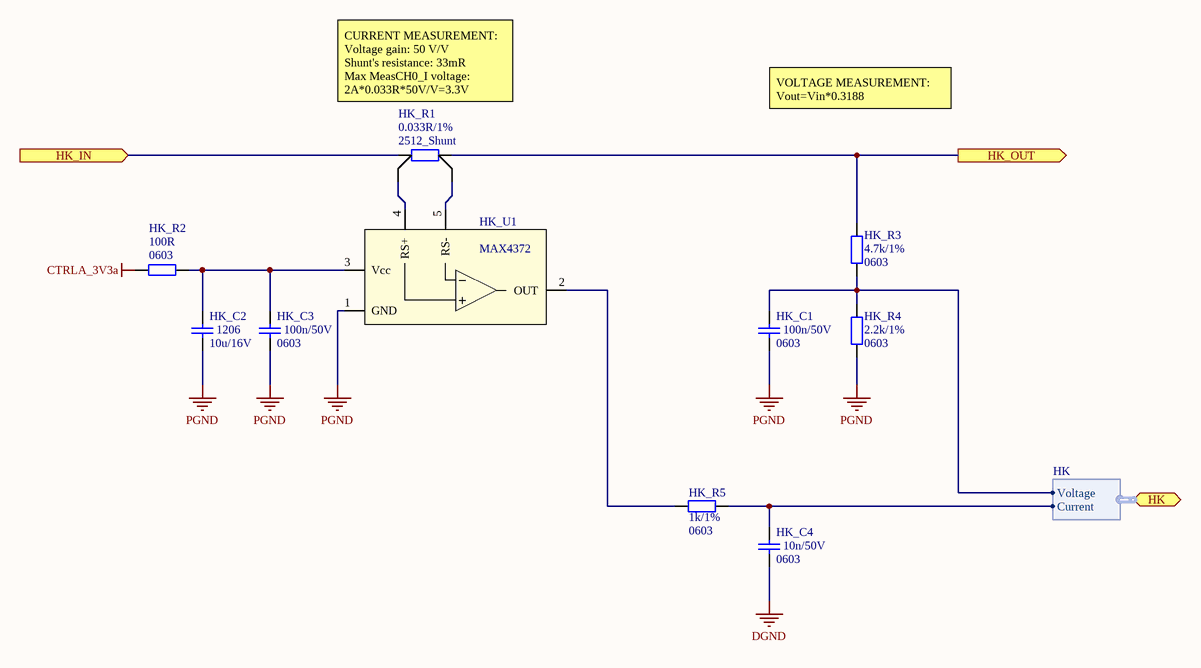
[diagram p35: EPS_Distribution_Measurements.SchDoc]

### Parts
HK_C1  Package: 0603  [SMD_Capacitor_0603]  (hidden comment: 100n/50V)
HK_C2  Packge: 1206  [SMD_Capacitor_1206]  (hidden comment: 10u/16V)
HK_C3  Package: 0603  [SMD_Capacitor_0603]  (hidden comment: 100n/50V)
HK_C4  Package: 0603  [SMD_Capacitor_0603]  (hidden comment: 10n/50V)
HK_R1  Package: 2512_Shunt  [SMD_Resistor-shunt_2512]  (hidden comment: 0.033R/1%)
HK_R2  Package: 0603  [SMD_Resistor_0603]  (hidden comment: 100R)
HK_R3  Package: 0603  [SMD_Resistor_0603]  (hidden comment: 4.7k/1%)
HK_R4  Package: 0603  [SMD_Resistor_0603]  (hidden comment: 2.2k/1%)
HK_R5  Package: 0603  [SMD_Resistor_0603]  (hidden comment: 1k/1%)
HK_U1  MAX4372  [SOT23-5]

### Ports
HK (harness HK), HK_IN (in), HK_OUT (out)

### Harnesses
HK: Voltage, Current

### Nets
CTRLA_3V3a: HK_R2.1
DGND: HK_C4.2
PGND: HK_C1.2 HK_C2.2 HK_C3.2 HK_R4.2 HK_U1.1(GND)
HK_IN: HK_R1.1 ; port HK_IN
HK_OUT: HK_R1.4 HK_R3.1 ; port HK_OUT
NetHK_C1_1: HK_C1.1 HK_R3.2 HK_R4.1 ; port HK.Voltage
NetHK_C2_1: HK_C2.1 HK_C3.1 HK_R2.2 HK_U1.3(Vcc)
NetHK_C4_1: HK_C4.1 HK_R5.2 ; port HK.Current
NetHK_R1_2: HK_R1.2 HK_U1.4(RS+)
NetHK_R1_3: HK_R1.3 HK_U1.5(RS-)
NetHK_R5_1: HK_R5.1 HK_U1.2(OUT)

### Channels
Top/Distribution/5V Measurements: designators end in _5V_Measurements; ports HK_IN=NetEMIBB_C1_1 HK_OUT=NetHK_R1_5V_Measurements_4
Top/Distribution/3V3 Measurements: designators end in _3V3_Measurements; ports HK_IN=NetEMIAB_C1_1 HK_OUT=NetHK_R1_3V3_Measurements_4
Top/Distribution/VBAT Measurements: designators end in _VBAT_Measurements; ports HK_IN=NetEMIVBAT_C1_1 HK_OUT=PC-104_LCL_VBAT

### Notes on the sheet
- CURRENT MEASUREMENT:
  Voltage gain: 50 V/V
  Shunt's resistance: 33mR
  Max MeasCH0_I voltage: 2A*0.033R*50V/V=3.3V
- VOLTAGE MEASUREMENT:
  Vout=Vin*0.3188
- Title:
- Project:
- Author:
- Model:
- Document Number:
- Checked by:
- Rev:
- Date:
- Approved by:
- Sheet:
- of
- File name:

### Library data of the parts
HK_C1 HK_C3 HK_C4 = Cer_C0603T104K5RALTU: Ceramic Cap Kemet COTS 100n/50V X7R 0603; Manufacturer: Kemet; ManufacturerPartNumber: C0603T104K5RALTU
  HK_C1 HK_C3: Value: 100n/50V
  HK_C4: Value: 10n/50V
HK_C2 = Cer_C1206T106K4RACTU: Ceramic Cap Kemet COTS 10u/16V X7R 1206; ManufacturerPartNumber: C1206T106K4RACTU; Manufacturer: Kemet; Value: 10u/16V
HK_R1 = LR2512-R033FW: 33mR ,1%, 2W, shunt resistor, TE Connectivity.; ManufacturerPartNumber: LR2512-R033FW; Manufacturer: TE Connectivity; Power Rating: 2W; Value: 0.033R/1%
HK_R2-HK_R5 = Res
  HK_R2: Value: 100R
  HK_R3: Value: 4.7k/1%
  HK_R4: Value: 2.2k/1%
  HK_R5: Value: 1k/1%
HK_U1 = MAX4372: High-Side Current-Sense Amplifier with Voltage Output; Manufacturer: Maxim Integrated Products; Value: MAX4372

## Sheet EPS_VBAT.SchDoc: VBAT
size A4; ApprovedBy: (not approved); CheckedBy: (not checked); Author: Piotr Kuligowski; DocumentNumber: PWSat2-xxx-DW-xxx; Revision: 2; Model: EM2
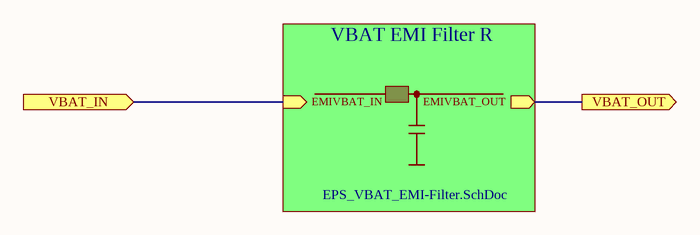
[diagram p36: EPS_VBAT.SchDoc]

### Sub-sheets
VBAT EMI Filter R = EPS_VBAT_EMI-Filter.SchDoc: EMIVBAT_OUT (out), EMIVBAT_IN (in)

### Ports
VBAT_IN (in), VBAT_OUT (out)

### Nets
NetEMIVBAT_C1_1: port VBAT_OUT, sheet VBAT EMI Filter R/EMIVBAT_OUT
NetEMIVBAT_FB1_2: port VBAT_IN, sheet VBAT EMI Filter R/EMIVBAT_IN

### Notes on the sheet
- Title:
- Project:
- Author:
- Model:
- Document Number:
- Checked by:
- Rev:
- Date:
- Approved by:
- Sheet:
- of
- File name:

## Sheet EPS_VBAT_EMI-Filter.SchDoc: VBAT / EMI Filter
size A4; Date: 2015-10-11; Author: Piotr Kuligowski; Revision: 1-0; SheetTotal: 14; Model: EM1
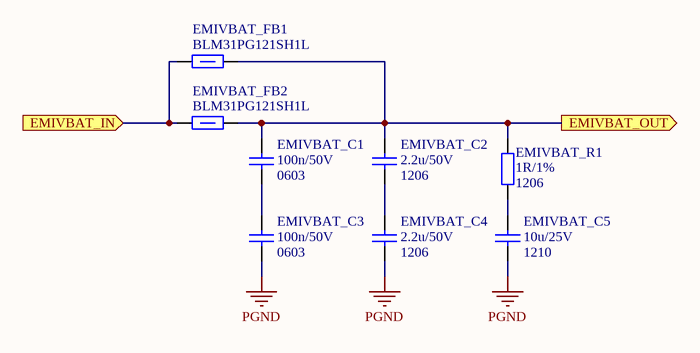
[diagram p37: EPS_VBAT_EMI-Filter.SchDoc]

### Parts
EMIVBAT_C1  Package: 0603  [SMD_Capacitor_0603]  (hidden comment: 100n/50V)
EMIVBAT_C2  Package: 1206  [SMD_Capacitor_1206]  (hidden comment: 2.2u/50V)
EMIVBAT_C3  Package: 0603  [SMD_Capacitor_0603]  (hidden comment: 100n/50V)
EMIVBAT_C4  Package: 1206  [SMD_Capacitor_1206]  (hidden comment: 2.2u/50V)
EMIVBAT_C5  Package: 1210  [SMD_Capacitor_1210]  (hidden comment: 10u/25V)
EMIVBAT_FB1  120R/100MHz  [SMD_FerriteBead_1206]  (value not drawn)
EMIVBAT_FB2  120R/100MHz  [SMD_FerriteBead_1206]  (value not drawn)
EMIVBAT_R1  Package: 1206  [SMD_Resistor_1206]  (hidden comment: 1R/1%)

### Ports
EMIVBAT_IN (in), EMIVBAT_OUT (out)

### Nets
PGND: EMIVBAT_C3.2 EMIVBAT_C4.2 EMIVBAT_C5.2
NetEMIVBAT_C1_1: EMIVBAT_C1.1 EMIVBAT_C2.1 EMIVBAT_FB1.1 EMIVBAT_FB2.1 EMIVBAT_R1.1 ; port EMIVBAT_OUT
NetEMIVBAT_C1_2: EMIVBAT_C1.2 EMIVBAT_C3.1
NetEMIVBAT_C2_2: EMIVBAT_C2.2 EMIVBAT_C4.1
NetEMIVBAT_C5_1: EMIVBAT_C5.1 EMIVBAT_R1.2
NetEMIVBAT_FB1_2: EMIVBAT_FB1.2 EMIVBAT_FB2.2 ; port EMIVBAT_IN

### Notes on the sheet
- Title:
- Project:
- Author:
- Model:
- Document Number:
- Checked by:
- Rev:
- Date:
- Approved by:
- Sheet:
- of
- File name:

### Library data of the parts
EMIVBAT_C1 EMIVBAT_C3 = Cer_C0603T104K5RALTU: Ceramic Cap Kemet COTS 100n/50V X7R 0603; Manufacturer: Kemet; ManufacturerPartNumber: C0603T104K5RALTU; Value: 100n/50V
EMIVBAT_C2 EMIVBAT_C4 = Cer_GCJ31CR71H225KA12L: Ceramic Cap Murata Automotive 2.2u/50V X7R 1206; Manufacturer: Murata; ManufacturerPartNumber: GCJ31CR71H225KA12L; Value: 2.2u/50V
EMIVBAT_C5 = Cer_GCJ32ER71E106KA12L: as EMIBA_C1-EMIBA_C3 on sheet EPS_5V_EMI-Filter_In; Manufacturer: Murata; ManufacturerPartNumber: GCJ32ER71E106KA12L; Value: 10u/25V
EMIVBAT_FB1 EMIVBAT_FB2 = BLM31PG121SH1L: as EMIBB_FB1 on sheet EPS_5V_EMI-Filter_Out; Package: 1206; Value: 120R/100MHz; ManufacturerPartNumber: BLM31PG121SH1L
EMIVBAT_R1 = CRCW12061R00FKxxxx: as EMIBB_R1 on sheet EPS_5V_EMI-Filter_Out; ManufacturerPartNumber: CRCW12061R00FKxxxx; Manufacturer: Vishay; Value: 1R/1%